# Altium project ash-power.PrjPCB (part 1 of 2)
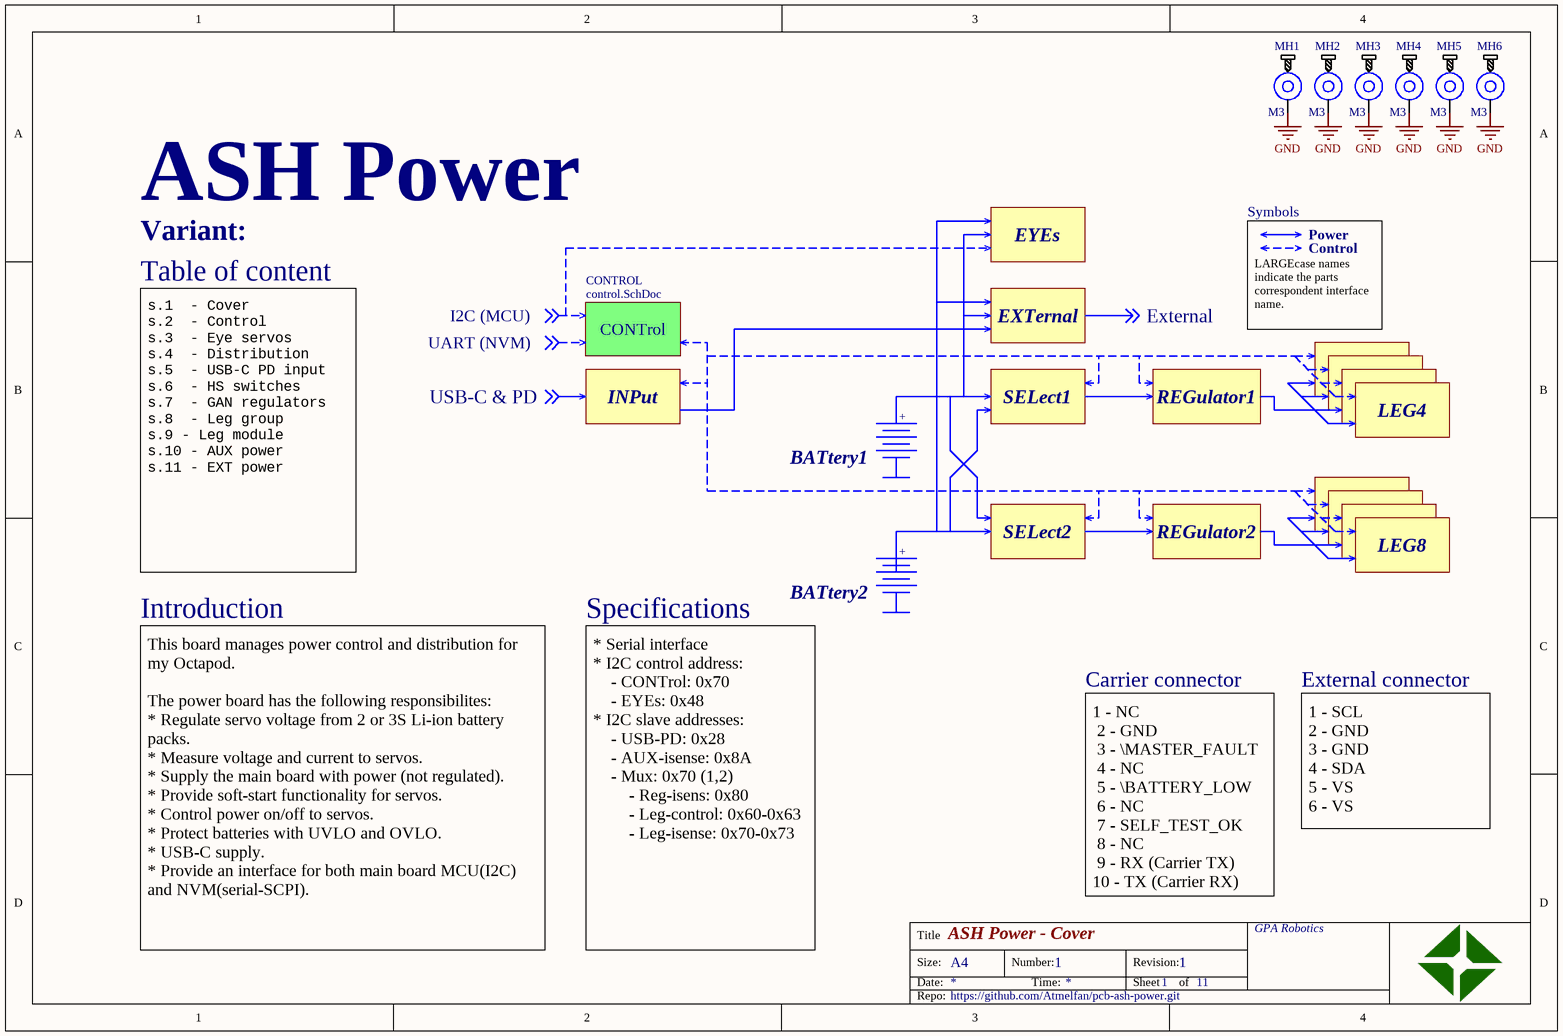
[diagram p0: cover.SchDoc]
project_author: Gustav Palmqvist; project_name: ASH Power; project_repo: https://github.com/Atmelfan/pcb-ash-power.git; project_revision: 1
11 sheets, 589 parts. Net scope: flat (ports and power ports of the same name join across sheets).
Board file: pcb-ash-power.PcbDoc
Sheets:
  cover.SchDoc
    CONTROL = control.SchDoc
      POW = power.SchDoc
        EXT = ext_power.SchDoc
        HS_R = hs_switch.SchDoc
        HS_L = hs_switch.SchDoc
        USB = usbpd_input.SchDoc
        LEG_R = leg_group.SchDoc
          LEG1 = leg_module.SchDoc
          LEG2 = leg_module.SchDoc
          LEG3 = leg_module.SchDoc
          LEG4 = leg_module.SchDoc
        LEG_L = leg_group.SchDoc
          LEG1 = leg_module.SchDoc
          LEG2 = leg_module.SchDoc
          LEG3 = leg_module.SchDoc
          LEG4 = leg_module.SchDoc
        REG_R = gan_buck.SchDoc
        REG_L = gan_buck.SchDoc
      AUX = aux_power.SchDoc
      EYES = servos.SchDoc

## Sheet cover.SchDoc: Cover
size A4; Organization: GPA Robotics; DocumentNumber: 1; SheetNumber: 1; SheetTotal: 11

### Parts
MH1  M3  [mount_m3_normal]
MH2  M3  [mount_m3_normal]
MH3  M3  [mount_m3_normal]
MH4  M3  [mount_m3_normal]
MH5  M3  [mount_m3_normal]
MH6  M3  [mount_m3_normal]

### Sub-sheets
CONTROL = control.SchDoc: no entries

### Nets
GND: MH1.1 MH2.1 MH3.1 MH4.1 MH5.1 MH6.1

### Notes on the sheet
- EYEs
- Symbols
- Power
- Control
- Table of content
- I2C (MCU)
- EXTernal
- External
- UART (NVM)
- CONTrol
- LARGEcase names indicate the parts correspondent interface name.
- USB-C & PD
- INPut
- +
- SELect1
- REGulator1
- LEG4
- BATtery1
- s.1  - Cover
  s.2  - Control
  s.3  - Eye servos
  s.4  - Distribution
  s.5  - USB-C PD input
  s.6  - HS switches
  s.7  - GAN regulators
  s.8  - Leg group
  s.9 - Leg module
  s.10 - AUX power
  s.11 - EXT power
- SELect2
- REGulator2
- LEG8
- Introduction
- Specifications
- BATtery2
- Carrier connector
- External connector
- 1 - SCL
  2 - GND
  3 - GND
  4 - SDA
  5 - VS
  6 - VS
- 1 - NC
  2 - GND
  3 - \MASTER_FAULT
  4 - NC
  5 - \BATTERY_LOW
  6 - NC
  7 - SELF_TEST_OK
  8 - NC
  9 - RX (Carrier TX)
  10 - TX (Carrier RX)
- This board manages power control and distribution for my Octapod.
  The power board has the following responsibilites:
  * Regulate servo voltage from 2 or 3S Li-ion battery packs.
  * Measure voltage and current to servos.
  * Supply the main board with power (not regulated).
  * Provide soft-start functionality for servos.
  * Control power on/off to servos.
  * Protect batteries with UVLO and OVLO.
  * USB-C supply.
  * Provide an interface for both main board MCU(I2C) and NVM(serial-SCPI).
- * Serial interface
  * I2C control address:
  - CONTrol: 0x70
  - EYEs: 0x48
  * I2C slave addresses:
  - USB-PD: 0x28
  - AUX-isense: 0x8A
  - Mux: 0x70 (1,2)
  - Reg-isens: 0x80
  - Leg-control: 0x60-0x63
  - Leg-isense: 0x70-0x73
- Variant:
- Title
- Size:
- Date:
- A4
- Number:
- Time:
- Revision:
- Sheet
- of
- Repo:

### Library data of the parts
MH1-MH6 = mounting_hole: Mounting hole

## Sheet control.SchDoc: Control
size A4; Organization: GPA Robotics; DocumentNumber: 2; Revision: REV 0; SheetNumber: 2; SheetTotal: 11
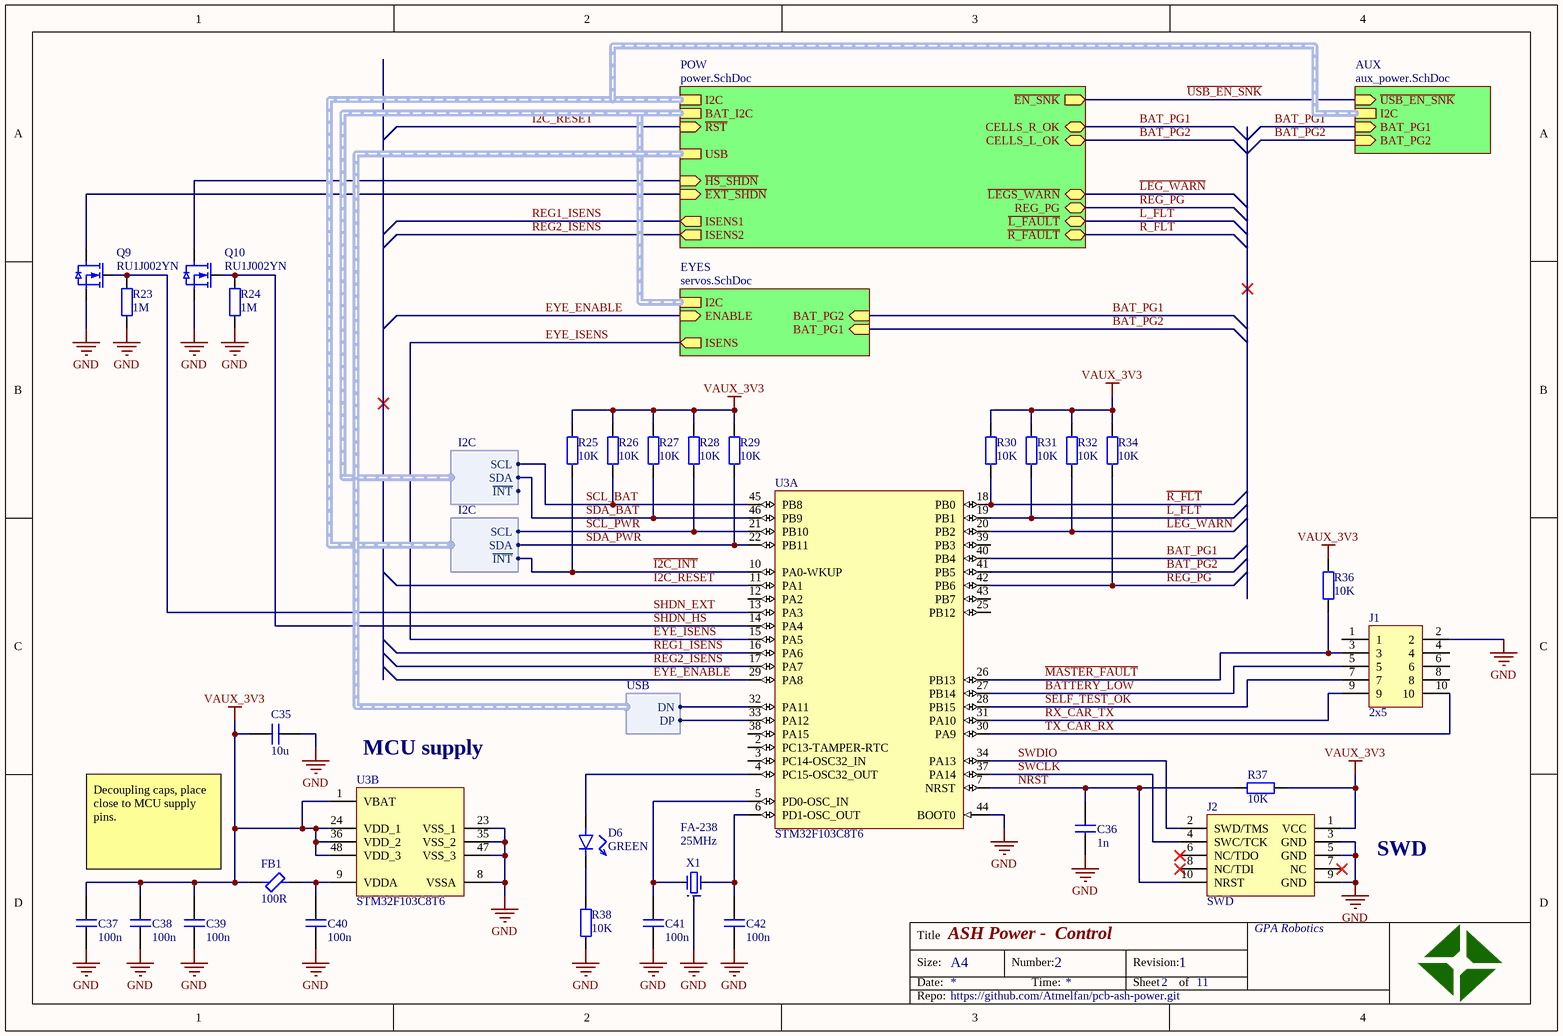
[diagram p1: control.SchDoc]

### Parts
C35  value 10u  [CAPC3216X14N]  (hidden comment: cap)
C36  value 1n  [CAPC1005X06N]  (hidden comment: cap)
C37  value 100n  [CAPC1005X06N]  (hidden comment: cap)
C38  value 100n  [CAPC1005X06N]  (hidden comment: cap)
C39  value 100n  [CAPC1005X06N]  (hidden comment: cap)
C40  value 100n  [CAPC1005X06N]  (hidden comment: cap)
C41  value 100n  [CAPC1005X06N]  (hidden comment: cap)
C42  value 100n  [CAPC1005X06N]  (hidden comment: cap)
D6  value GREEN  [CAPCP1005X06N]  (hidden comment: led)
FB1  value 100R  [INDC1005X06N]  (hidden comment: ferrite)
J1  2x5  [hdr_2x5_50mil]
J2  SWD  [hdr_2x5_50mil]
Q9  RU1J002YN  [SOTFL65P210X105-3N]
Q10  RU1J002YN  [SOTFL65P210X105-3N]
R23  value 1M  [RESC1005X04N]  (hidden comment: res)
R24  value 1M  [RESC1005X04N]  (hidden comment: res)
R25  value 10K  [RESC1005X04N]  (hidden comment: res)
R26  value 10K  [RESC1005X04N]  (hidden comment: res)
R27  value 10K  [RESC1005X04N]  (hidden comment: res)
R28  value 10K  [RESC1005X04N]  (hidden comment: res)
R29  value 10K  [RESC1005X04N]  (hidden comment: res)
R30  value 10K  [RESC1005X04N]  (hidden comment: res)
R31  value 10K  [RESC1005X04N]  (hidden comment: res)
R32  value 10K  [RESC1005X04N]  (hidden comment: res)
R34  value 10K  [RESC1005X04N]  (hidden comment: res)
R36  value 10K  [RESC1005X04N]  (hidden comment: res)
R37  value 10K  [RESC1005X04N]  (hidden comment: res)
R38  value 10K  [RESC1005X04N]  (hidden comment: res)
U3  STM32F103C8T6  [STM-LQFP48_N]  (parts A,B of 2)
X1  FA-238  freq: 25MHz  [DFN220P320X70-4N]

### Sub-sheets
AUX = aux_power.SchDoc: BAT_PG2 (in), BAT_PG1 (in), ~{USB_EN_SNK} (in), I2C (harness I2C)
EYES = servos.SchDoc: ISENS (out), BAT_PG2 (in), BAT_PG1 (in), I2C (harness I2C), ENABLE (in)
POW = power.SchDoc: ~{RST} (in), ~{HS_SHDN} (in), CELLS_R_OK (bidir), ~{LEGS_WARN} (bidir), CELLS_L_OK (bidir), ~{L_FAULT} (bidir), ~{R_FAULT} (bidir), ~{EN_SNK} (out), I2C (harness I2C), BAT_I2C (harness I2C), ~{EXT_SHDN} (in), ISENS1 (out), ISENS2 (out), REG_PG (bidir), USB (harness USB)

### Harnesses
I2C: SDA, SCL, ~{INT}
USB: DP, DN

### Nets
GND: C35.2 C36.1 C37.1 C38.1 C39.1 C40.1 C41.1 C42.1 J1.2 J2.3(GND) J2.5(GND) J2.9(GND) Q9.2(S) Q10.2(S) R23.1 R24.1 R38.1 U3.8(VSSA) U3.23(VSS_1) U3.35(VSS_2) U3.44(BOOT0) U3.47(VSS_3) X1.SHIELD
VAUX_3V3: C35.1 C37.2 C38.2 C39.2 FB1.1 J2.1(VCC) R25.2 R26.2 R27.2 R28.2 R29.2 R30.2 R31.2 R32.2 R34.2 R36.2 R37.1 U3.1(VBAT) U3.24(VDD_1) U3.36(VDD_2) U3.48(VDD_3)
~{BATTERY_LOW}: J1.5 U3.27(PB14)
~{I2C_INT}: R25.1 U3.10(PA0-WKUP) ; sheet POW/I2C.~{INT}
~{L_FLT}: R31.1 U3.19(PB1) ; sheet POW/~{L_FAULT}
~{LEG_WARN}: R32.1 U3.20(PB2) ; sheet POW/~{LEGS_WARN}
~{MASTER_FAULT}: J1.3 R36.1 U3.26(PB13)
~{R_FLT}: R30.1 U3.18(PB0) ; sheet POW/~{R_FAULT}
~{USB_EN_SNK}: sheet POW/~{EN_SNK}, sheet AUX/~{USB_EN_SNK}
BAT_PG1: U3.40(PB4) ; sheet POW/CELLS_R_OK, sheet AUX/BAT_PG1, sheet EYES/BAT_PG2
BAT_PG2: U3.41(PB5) ; sheet POW/CELLS_L_OK, sheet AUX/BAT_PG2, sheet EYES/BAT_PG1
EYE_ENABLE: U3.29(PA8) ; sheet EYES/ENABLE
EYE_ISENS: U3.15(PA5) ; sheet EYES/ISENS
I2C_RESET: U3.11(PA1) ; sheet POW/~{RST}
NRST: C36.2 J2.10(NRST) R37.2 U3.7(NRST)
REG1_ISENS: U3.16(PA6) ; sheet POW/ISENS1
REG2_ISENS: U3.17(PA7) ; sheet POW/ISENS2
REG_PG: R34.1 U3.42(PB6) ; sheet POW/REG_PG
RX_CAR_TX: J1.9 U3.31(PA10)
SCL_BAT: R26.1 U3.45(PB8) ; sheet POW/BAT_I2C.SCL
SCL_PWR: R28.1 U3.21(PB10) ; sheet POW/I2C.SCL
SDA_BAT: R27.1 U3.46(PB9) ; sheet POW/BAT_I2C.SDA
SDA_PWR: R29.1 U3.22(PB11) ; sheet POW/I2C.SDA
SELF_TEST_OK: J1.7 U3.28(PB15)
SHDN_EXT: Q9.1(G) R23.2 U3.13(PA3)
SHDN_HS: Q10.1(G) R24.2 U3.14(PA4)
SWCLK: J2.4(SWC/TCK) U3.37(PA14)
SWDIO: J2.2(SWD/TMS) U3.34(PA13)
TX_CAR_RX: J1.10 U3.30(PA9)
NetC40_2: C40.2 FB1.2 U3.9(VDDA)
NetC41_2: C41.2 U3.5(PD0-OSC_IN) X1.1
NetC42_2: C42.2 U3.6(PD1-OSC_OUT) X1.2
NetD6_A: D6.A U3.4(PC15-OSC32_OUT)
NetD6_C: D6.C R38.2
NetQ9_3: Q9.3(D) ; sheet POW/~{EXT_SHDN}
NetQ10_3: Q10.3(D) ; sheet POW/~{HS_SHDN}
NetU3_32: U3.32(PA11) ; sheet POW/USB.DN
NetU3_33: U3.33(PA12) ; sheet POW/USB.DP

Not connected (* = marked no-connect by the designer): J1 1 4 6 8; J2 6(NC/TDO)* 7(NC)* 8(NC/TDI)*; U3 2(PC13-TAMPER-RTC) 3(PC14-OSC32_IN) 12(PA2) 25(PB12) 38(PA15) 39(PB3) 43(PB7)

### Buses and harness runs
harness sheet AUX/I2C = sheet POW/I2C
harness sheet EYES/I2C = sheet POW/BAT_I2C

### Notes on the sheet
- (near U3) MCU supply
- SWD
- Decoupling caps, place close to MCU supply pins.
- Title
- Size:
- Date:
- A4
- Number:
- Time:
- Revision:
- Sheet
- of
- Repo:

### Library data of the parts
C35-C42 = cap: Capacitor; voltage: *; type: *; #digikey: *; #mouser: *
D6 = led: pin to pad: A>1 C>2
FB1 = ferrite: Inductor; #digikey: *; #mouser: *
J1 = hdr_2x5: 2x5 Header
J2 = hdr_swd: SWD Header
Q9 Q10 = ru1j002yn: N-channel 50V 200mA Small signal MOSFET; ComponentLink1Description: datasheet; ComponentLink1URL: https://www.mouser.se/datasheet/2/348/ru1j002yn-e-1018335.pdf
R23-R32 R34 R36-R38 = res: Resistor; power: *; voltage: *; #digikey: *; #mouser: *
U3 = STM32F103C8T6: ARM Cortex-M3 32-bit MCU, 64 KB Flash, 20 KB Internal RAM, 37 I/Os, 48-pin LQFP, -40 to 85 degC, Tray; A/D Converter: 2x12-bit (10 Channel); FLASH Size (Prog) (kB): 64; I/Os (High Current): 37; Internal RAM Size (kB): 20; Operating Frequency(F) (Processor speed) (MHz): 72; Supply Voltage(Vcc) min (V): 2; DatasheetVersion: Rev. 16; PackageVersion: Rev. 6, 06/2013; PackageReference: LQFP48; PackageDescription: 48-Pin Low Profile Quad Flat Package, 7 x 7 mm Body, 0.5 mm Pitch; Supplier 1: Digi-Key; Supplier Part Number 1: 497-6063-ND; Supplier 2: Farnell; Supplier Part Number 2: 1447637; Supplier 3: Newark; Supplier Part Number 3: 59M2182; Supplier 4: Newark; Supplier Part Number 4: 57P1222; Supplier 5: Mouser; Supplier Part Number 5: 511-STM32F103C8T6; Core: ARM Cortex-M3; Packing: Tray; Mounting Technology: Surface Mount; PartNumber: STM32F103C8T6; ComponentLink1Description: Manufacturer URL; ComponentLink1URL: http://www.st.com/web/en/home.html; ComponentLink2Description: Datasheet; ComponentLink2URL: http://www.st.com/st-web-ui/static/active/en/resource/technical/document/datasheet/CD00161566.pdf; ComponentLink3Description: Package Specification; ComponentLink3URL: http://www.st.com/st-web-ui/static/active/en/resource/technical/document/datasheet/DM00058181.pdf
X1 = crystal: Crystal With Shield; #digikey: *; #mouser: *

## Sheet power.SchDoc: Power
size A3; Organization: GPA Robotics; DocumentNumber: 4; Revision: REV 0; SheetNumber: 4; SheetTotal: 11
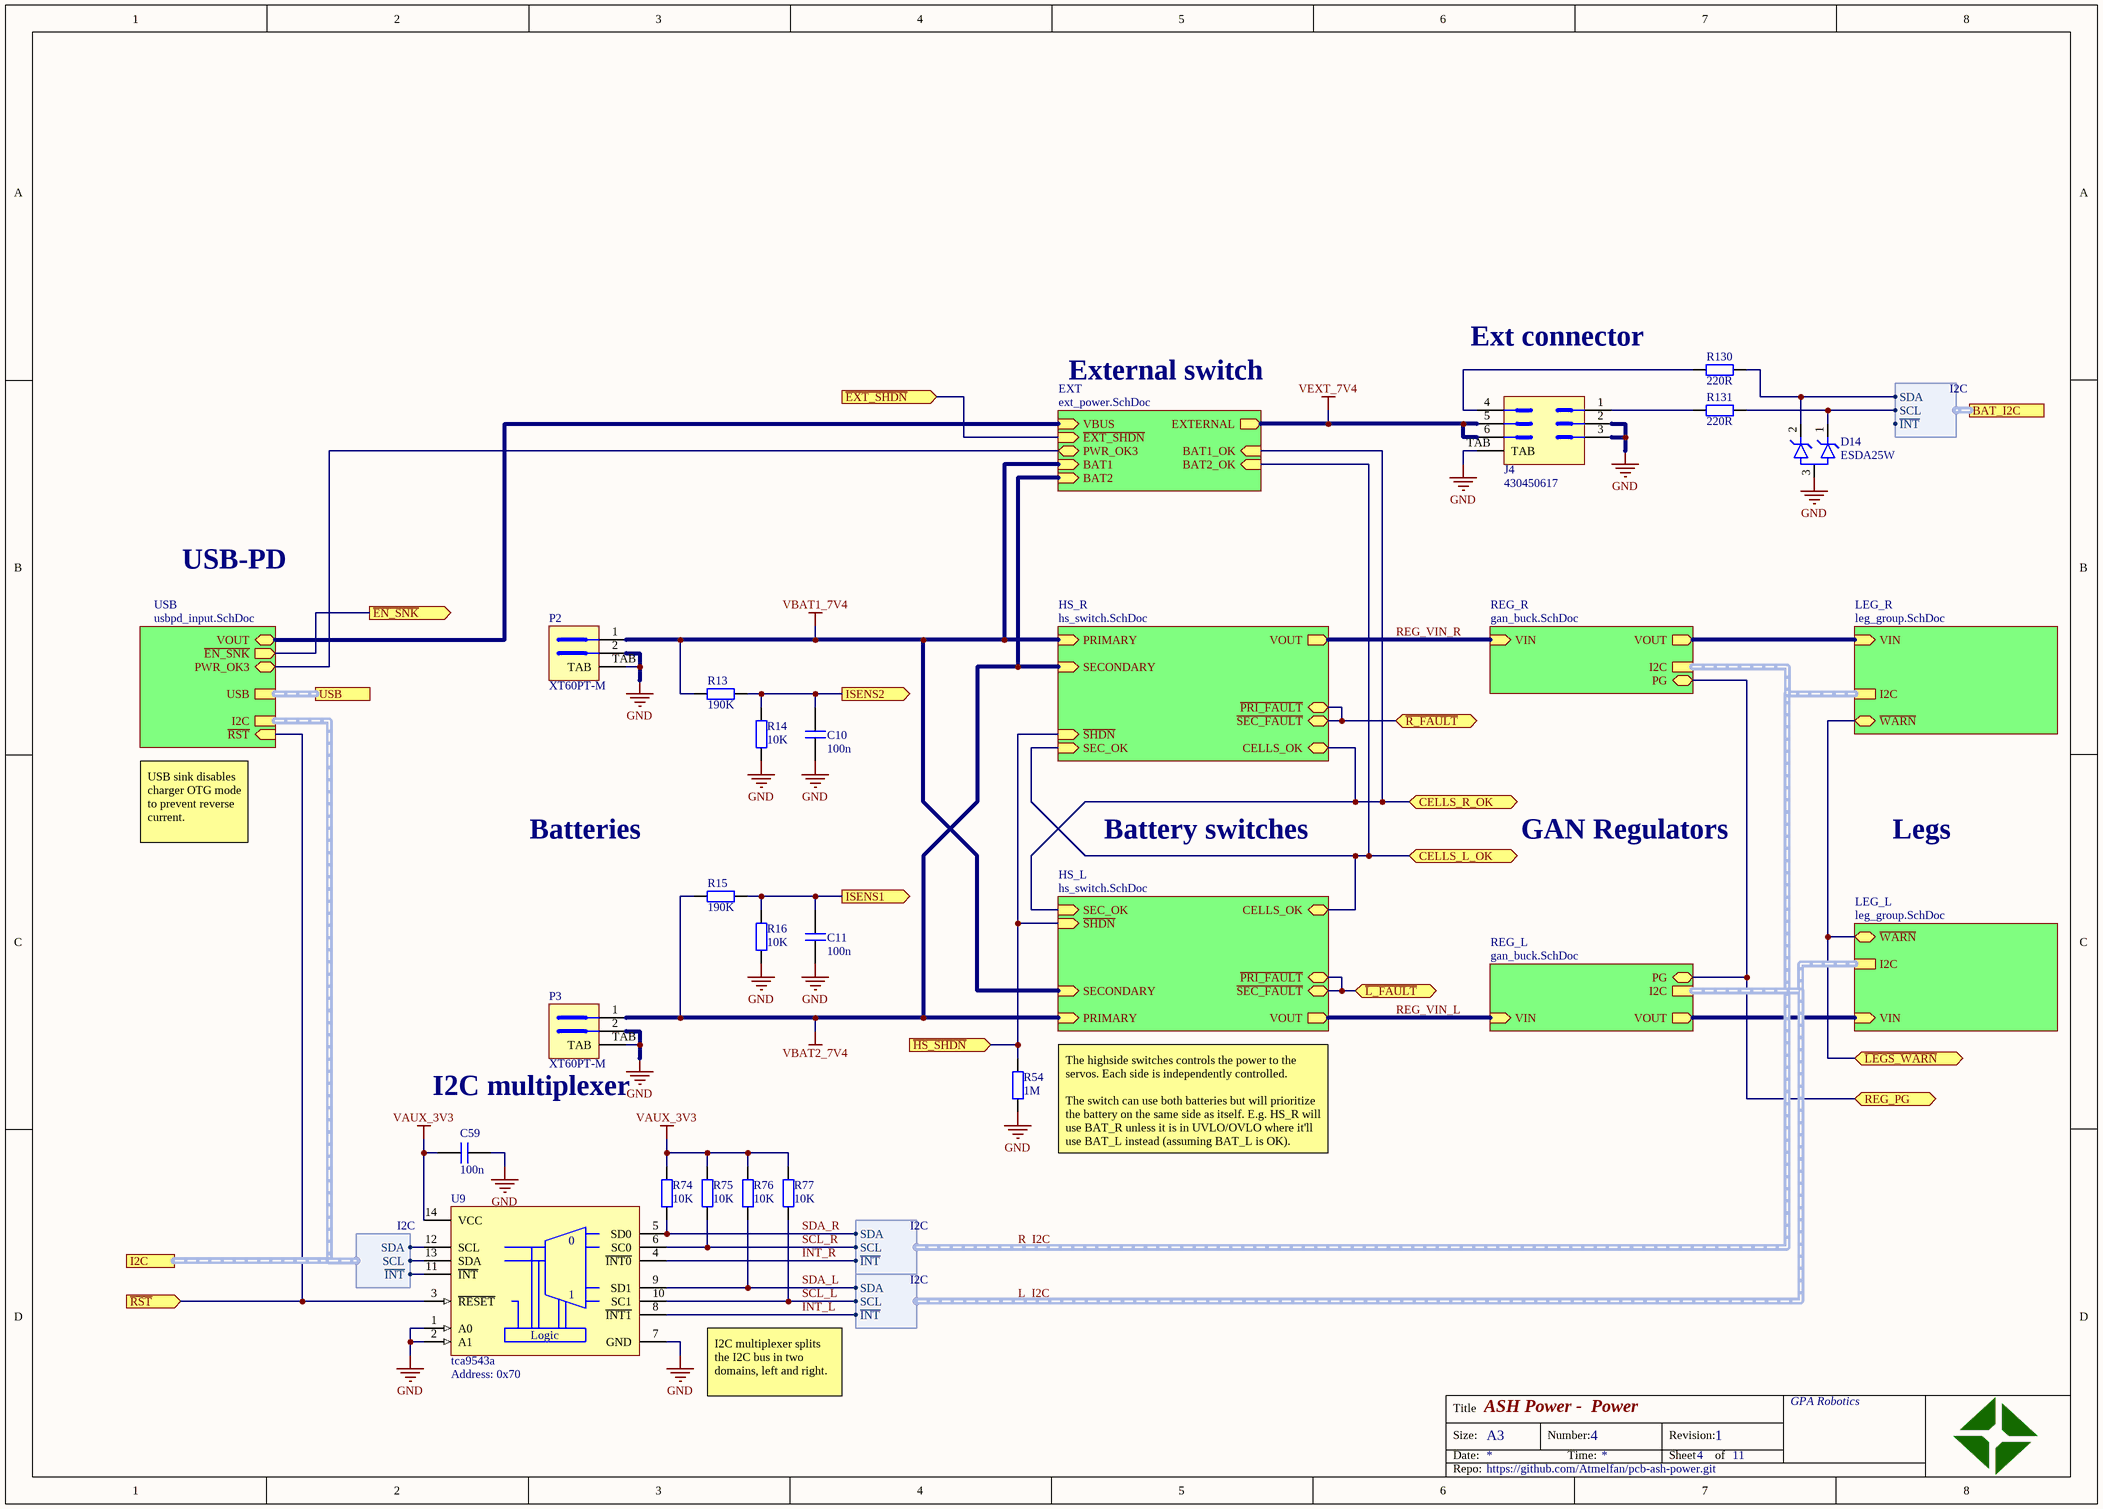
[diagram p2: power.SchDoc]

### Parts
C10  value 100n  [CAPC1005X06N]  (hidden comment: cap)
C11  value 100n  [CAPC1005X06N]  (hidden comment: cap)
C59  value 100n  [CAPC1005X06N]  (hidden comment: cap)
D14  ESDA25W  [SOT65P210X110-3N_SOT323-3L]
J4  430450617  [430450617]
P2  XT60PT-M  [XT60PT-M]
P3  XT60PT-M  [XT60PT-M]
R13  value 190K  [RESC1005X04N]  (hidden comment: res)
R14  value 10K  [RESC1005X04N]  (hidden comment: res)
R15  value 190K  [RESC1005X04N]  (hidden comment: res)
R16  value 10K  [RESC1005X04N]  (hidden comment: res)
R54  value 1M  [RESC1005X04N]  (hidden comment: res)
R74  value 10K  [RESC1005X04N]  (hidden comment: res)
R75  value 10K  [RESC1005X04N]  (hidden comment: res)
R76  value 10K  [RESC1005X04N]  (hidden comment: res)
R77  value 10K  [RESC1005X04N]  (hidden comment: res)
R130  value 220R  [RESC1005X04N]  (hidden comment: res)
R131  value 220R  [RESC1005X04N]  (hidden comment: res)
U9  tca9543a  Address: 0x70  [TSOP65P640X120-14N_PCA9543A]

### Sub-sheets
EXT = ext_power.SchDoc: BAT1 (in), BAT2 (in), VBUS (in), BAT1_OK (in), EXTERNAL (out), BAT2_OK (in), ~{EXT_SHDN} (in), PWR_OK3 (bidir)
HS_L = hs_switch.SchDoc: PRIMARY (in), SECONDARY (in), SEC_OK (in), CELLS_OK (bidir), VOUT (out), ~{SEC_FAULT} (bidir), ~{PRI_FAULT} (bidir), ~{SHDN} (in)
HS_R = hs_switch.SchDoc: PRIMARY (in), SECONDARY (in), SEC_OK (in), CELLS_OK (bidir), VOUT (out), ~{PRI_FAULT} (bidir), ~{SEC_FAULT} (bidir), ~{SHDN} (in)
LEG_L = leg_group.SchDoc: VIN (in), ~{WARN} (bidir), I2C (harness I2C)
LEG_R = leg_group.SchDoc: VIN (in), ~{WARN} (bidir), I2C (harness I2C)
REG_L = gan_buck.SchDoc: VOUT (out), VIN (in), PG (bidir), I2C (harness I2C)
REG_R = gan_buck.SchDoc: VOUT (out), VIN (in), PG (bidir), I2C (harness I2C)
USB = usbpd_input.SchDoc: VOUT (bidir), ~{RST} (in), ~{EN_SNK} (out), I2C (harness I2C), USB (harness USB), PWR_OK3 (bidir)

### Ports
BAT_I2C (harness I2C), CELLS_L_OK (bidir), CELLS_R_OK (bidir), I2C (harness I2C), ISENS1 (out), ISENS2 (out), REG_PG (bidir), USB (harness USB), ~{EN_SNK} (out), ~{EXT_SHDN} (in), ~{HS_SHDN} (in), ~{L_FAULT} (bidir), ~{LEGS_WARN} (bidir), ~{R_FAULT} (bidir), ~{RST} (in)

### Harnesses
I2C: SDA, SCL, ~{INT}

### Nets
GND: C10.1 C11.1 C59.2 D14.3 J4.2 J4.3 J4.TAB P2.2 P2.TAB P3.2 P3.TAB R14.1 R16.1 R54.1 U9.1(A0) U9.2(A1) U9.7(GND)
VAUX_3V3: C59.1 R74.2 R75.2 R76.2 R77.2 U9.14(VCC)
VBAT1_7V4: P2.1 R13.1 ; sheet EXT/BAT1, sheet HS_R/PRIMARY, sheet HS_L/SECONDARY
VBAT2_7V4: P3.1 R15.1 ; sheet EXT/BAT2, sheet HS_R/SECONDARY, sheet HS_L/PRIMARY
VEXT_7V4: J4.5 J4.6 ; sheet EXT/EXTERNAL
~{EXT_SHDN}: port ~{EXT_SHDN}, sheet EXT/~{EXT_SHDN}
~{INT_L}: U9.8(~{INT1}) ; sheet LEG_L/I2C.~{INT}
~{INT_R}: U9.4(~{INT0}) ; sheet LEG_R/I2C.~{INT}
REG_VIN_L: sheet HS_L/VOUT, sheet REG_L/VIN
REG_VIN_R: sheet HS_R/VOUT, sheet REG_R/VIN
SCL_L: R77.1 U9.10(SC1) ; sheet LEG_L/I2C.SCL  [project net L_I2C.SCL]
SCL_R: R75.1 U9.6(SC0) ; sheet LEG_R/I2C.SCL  [project net R_I2C.SCL]
SDA_L: R76.1 U9.9(SD1) ; sheet LEG_L/I2C.SDA  [project net L_I2C.SDA]
SDA_R: R74.1 U9.5(SD0) ; sheet LEG_R/I2C.SDA  [project net R_I2C.SDA]
NetC10_2: C10.2 R13.2 R14.2 ; port ISENS2
NetC11_2: C11.2 R15.2 R16.2 ; port ISENS1
NetD14_1: D14.1 R131.2 ; port BAT_I2C.SCL
NetD14_2: D14.2 R130.2 ; port BAT_I2C.SDA
NetID3_CONTROL_POW_LEG_L_LEG1_2: U9.13(SDA) ; port I2C.SCL
NetID4_CONTROL_POW_LEG_L_LEG1_2: U9.12(SCL) ; port I2C.SDA
NetJ4_1: J4.1 R131.1
NetJ4_4: J4.4 R130.1
NetQ24_1: U9.3(~{RESET}) ; port ~{RST}, sheet USB/~{RST}
NetR54_2: R54.2 ; port ~{HS_SHDN}, sheet HS_R/~{SHDN}, sheet HS_L/~{SHDN}
NetR99_1: port ~{EN_SNK}, sheet USB/~{EN_SNK}
NetR103_2: U9.11(~{INT}) ; port I2C.~{INT}
(unnamed): port CELLS_R_OK, sheet EXT/BAT1_OK, sheet HS_R/CELLS_OK, sheet HS_L/SEC_OK
(unnamed): port CELLS_L_OK, sheet EXT/BAT2_OK, sheet HS_R/SEC_OK, sheet HS_L/CELLS_OK
(unnamed): port ~{LEGS_WARN}, sheet LEG_R/~{WARN}, sheet LEG_L/~{WARN}
(unnamed): port ~{R_FAULT}, sheet HS_R/~{PRI_FAULT}, sheet HS_R/~{SEC_FAULT}
(unnamed): port ~{L_FAULT}, sheet HS_L/~{SEC_FAULT}, sheet HS_L/~{PRI_FAULT}
(unnamed): port REG_PG, sheet REG_R/PG, sheet REG_L/PG
(unnamed): sheet EXT/VBUS, sheet USB/VOUT
(unnamed): sheet EXT/PWR_OK3, sheet USB/PWR_OK3
(unnamed): sheet LEG_R/VIN, sheet REG_R/VOUT
(unnamed): sheet LEG_L/VIN, sheet REG_L/VOUT

### Buses and harness runs
harness L_I2C = sheet LEG_L/I2C = sheet REG_L/I2C
harness port I2C = sheet USB/I2C
harness port USB = sheet USB/USB
harness R_I2C = sheet LEG_R/I2C = sheet REG_R/I2C

### Notes on the sheet
- External switch
- Ext connector
- USB-PD
- USB sink disables charger OTG mode to prevent reverse current.
- Batteries
- Battery switches
- GAN Regulators
- Legs
- (near P3) I2C multiplexer
- (near R54) The highside switches controls the power to the servos. Each side is independently controlled.
  The switch can use both batteries but will prioritize the battery on the same side as itself. E.g. HS_R will use BAT_R unless it is in UVLO/OVLO where it'll use BAT_L instead (assuming BAT_L is OK).
- I2C multiplexer splits the I2C bus in two domains, left and right.
- Title
- Size:
- Date:
- A3
- Number:
- Time:
- Revision:
- Sheet
- of
- Repo:
- (in symbol tca9543a) 0; Logic

### Library data of the parts
C10 C11 C59 = cap: Capacitor; voltage: *; type: *; #digikey: *; #mouser: *
D14 = esda25w: TRANSIL array for data protection; ComponentLink1Description: datasheet; ComponentLink1URL: https://www.st.com/content/ccc/resource/technical/document/datasheet/cd/9b/8d/39/1f/d4/43/ba/CD00064033.pdf/files/CD00064033.pdf/jcr:content/translations/en.CD00064033.pdf
J4 = 430450617: Micro-Fit 3.0 Vertical Header, 3.00mm Pitch, Dual Row, 6 Circuits, with PCB Press-fit Metal Retention Clip, Gold, Glow-Wire Capable, Black; ComponentLink1Description: drawing; ComponentLink1URL: https://www.molex.com/pdm_docs/sd/430450617_sd.pdf
R13-R16 R54 R74-R77 R130 R131 = res: Resistor; power: *; voltage: *; #digikey: *; #mouser: *
U9 = tca9543a: Low Voltage 2-Channel I2C Bus Switch With Interrupt Logic And Reset; ComponentLink1Description: datasheet; ComponentLink1URL: http://www.ti.com/lit/ds/symlink/tca9543a.pdf

## Sheet ext_power.SchDoc: External power
size A4; Organization: GPA Robotics; DocumentNumber: 11; Revision: REV 0; SheetNumber: 11; SheetTotal: 11
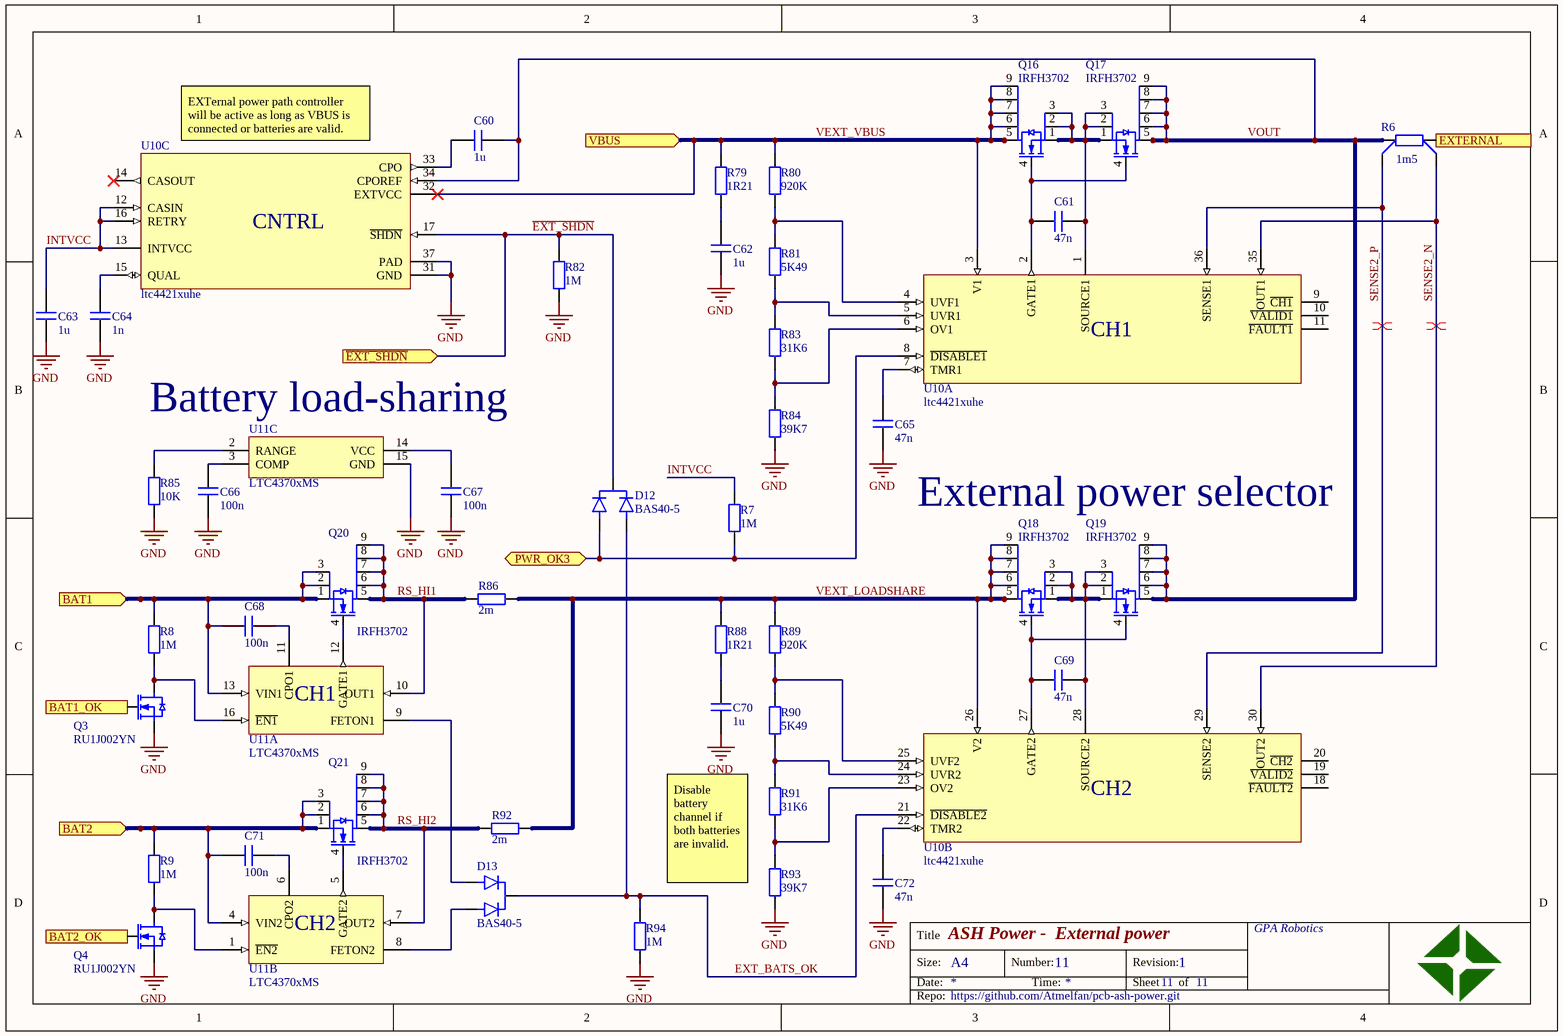
[diagram p3: ext_power.SchDoc]

### Parts
C60  value 1u  [CAPC2012X11N]  (hidden comment: cap)
C61  value 47n  [CAPC1005X06N]  (hidden comment: cap)
C62  value 1u  [CAPC2012X11N]  (hidden comment: cap)
C63  value 1u  [CAPC2012X11N]  (hidden comment: cap)
C64  value 1n  [CAPC1005X06N]  (hidden comment: cap)
C65  value 47n  [CAPC1005X06N]  (hidden comment: cap)
C66  value 100n  [CAPC1005X06N]  (hidden comment: cap)
C67  value 100n  [CAPC1005X06N]  (hidden comment: cap)
C68  value 100n  [CAPC1005X06N]  (hidden comment: cap)
C69  value 47n  [CAPC1005X06N]  (hidden comment: cap)
C70  value 1u  [CAPC2012X11N]  (hidden comment: cap)
C71  value 100n  [CAPC1005X06N]  (hidden comment: cap)
C72  value 47n  [CAPC1005X06N]  (hidden comment: cap)
D12  BAS40-5  [SOT23_CC]
D13  BAS40-5  [SOT23_CC]
Q3  RU1J002YN  [SOTFL65P210X105-3N]
Q4  RU1J002YN  [SOTFL65P210X105-3N]
Q16  IRFH3702  [PQFN67P300X300X100-8N]
Q17  IRFH3702  [PQFN67P300X300X100-8N]
Q18  IRFH3702  [PQFN67P300X300X100-8N]
Q19  IRFH3702  [PQFN67P300X300X100-8N]
Q20  IRFH3702  [PQFN67P300X300X100-8N]
Q21  IRFH3702  [PQFN67P300X300X100-8N]
R6  value 1m5  [4T_RESC1632X05N]  (hidden comment: res_4t)
R7  value 1M  [RESC1005X04N]  (hidden comment: res)
R8  value 1M  [RESC1005X04N]  (hidden comment: res)
R9  value 1M  [RESC1005X04N]  (hidden comment: res)
R79  value 1R21  [RESC2012X06N]  (hidden comment: res)
R80  value 920K  [RESC1005X04N]  (hidden comment: res)
R81  value 5K49  [RESC1005X04N]  (hidden comment: res)
R82  value 1M  [RESC1005X04N]  (hidden comment: res)
R83  value 31K6  [RESC1005X04N]  (hidden comment: res)
R84  value 39K7  [RESC1005X04N]  (hidden comment: res)
R85  value 10K  [RESC1005X04N]  (hidden comment: res)
R86  value 2m  [RESC3216X07N]  (hidden comment: res)
R88  value 1R21  [RESC2012X06N]  (hidden comment: res)
R89  value 920K  [RESC1005X04N]  (hidden comment: res)
R90  value 5K49  [RESC1005X04N]  (hidden comment: res)
R91  value 31K6  [RESC1005X04N]  (hidden comment: res)
R92  value 2m  [RESC3216X07N]  (hidden comment: res)
R93  value 39K7  [RESC1005X04N]  (hidden comment: res)
R94  value 1M  [RESC1005X04N]  (hidden comment: res)
U10  ltc4421xuhe  [QFN50P500X600X80_HS-37N_LTC4421]  (parts A,B,C of 3)
U11  LTC4370xMS  [TSSOP50P510X110-16N_ltc4421]  (parts A,B,C of 3)

### Ports
BAT1 (in), BAT1_OK (in), BAT2 (in), BAT2_OK (in), EXTERNAL (out), PWR_OK3 (bidir), VBUS (in), ~{EXT_SHDN} (in)

### Nets
GND: C62.1 C63.1 C64.1 C65.1 C66.1 C67.1 C70.1 C72.1 Q3.2(S) Q4.2(S) R82.1 R84.1 R85.1 R93.1 R94.1 U10.31(GND) U10.37(PAD) U11.15(GND)
~{EXT_SHDN}: D12.C R82.2 U10.17(~{SHDN}) ; port ~{EXT_SHDN}
EXT_BATS_OK: D12.A1 D13.C R94.2 U10.21(~{DISABLE2})
INTVCC: C63.2 R7.2 U10.12(CASIN) U10.13(INTVCC) U10.16(RETRY)
RS_HI1: Q20.5(D) Q20.6(D) Q20.7(D) Q20.8(D) Q20.9(D) R86.1 U11.10(OUT1)
RS_HI2: Q21.5(D) Q21.6(D) Q21.7(D) Q21.8(D) Q21.9(D) R92.1 U11.7(OUT2)
SENSE2_N: R6.4 U10.30(OUT2) U10.35(OUT1)
SENSE2_P: R6.3 U10.29(SENSE2) U10.36(SENSE1)
VEXT_LOADSHARE: Q18.5(D) Q18.6(D) Q18.7(D) Q18.8(D) Q18.9(D) R86.2 R88.2 R89.2 R92.2 U10.26(V2)
VEXT_VBUS: Q16.5(D) Q16.6(D) Q16.7(D) Q16.8(D) Q16.9(D) R79.2 R80.2 U10.3(V1) U10.32(EXTVCC) ; port VBUS
VOUT: C60.2 Q17.5(D) Q17.6(D) Q17.7(D) Q17.8(D) Q17.9(D) Q19.5(D) Q19.6(D) Q19.7(D) Q19.8(D) Q19.9(D) R6.1 U10.34(CPOREF)
NetC60_1: C60.1 U10.33(CPO)
NetC61_1: C61.1 Q16.4(G) Q17.4(G) U10.2(GATE1)
NetC61_2: C61.2 Q16.1(S) Q16.2(S) Q16.3(S) Q17.1(S) Q17.2(S) Q17.3(S) U10.1(SOURCE1)
NetC62_2: C62.2 R79.1
NetC64_2: C64.2 U10.15(QUAL)
NetC65_2: C65.2 U10.7(TMR1)
NetC66_2: C66.2 U11.3(COMP)
NetC67_2: C67.2 U11.14(VCC)
NetC68_1: C68.1 Q20.1(S) Q20.2(S) Q20.3(S) R8.2 U11.13(VIN1) ; port BAT1
NetC68_2: C68.2 U11.11(CPO1)
NetC69_1: C69.1 Q18.4(G) Q19.4(G) U10.27(GATE2)
NetC69_2: C69.2 Q18.1(S) Q18.2(S) Q18.3(S) Q19.1(S) Q19.2(S) Q19.3(S) U10.28(SOURCE2)
NetC70_2: C70.2 R88.1
NetC71_1: C71.1 Q21.1(S) Q21.2(S) Q21.3(S) R9.2 U11.4(VIN2) ; port BAT2
NetC71_2: C71.2 U11.6(CPO2)
NetC72_2: C72.2 U10.22(TMR2)
NetD12_A2: D12.A2 R7.1 U10.8(~{DISABLE1}) ; port PWR_OK3
NetD13_A1: D13.A1 U11.9(FETON1)
NetD13_A2: D13.A2 U11.8(FETON2)
NetQ3_1: Q3.1(G) ; port BAT1_OK
NetQ3_3: Q3.3(D) R8.1 U11.16(~{EN1})
NetQ4_1: Q4.1(G) ; port BAT2_OK
NetQ4_3: Q4.3(D) R9.1 U11.1(~{EN2})
NetQ20_4: Q20.4(G) U11.12(GATE1)
NetQ21_4: Q21.4(G) U11.5(GATE2)
NetR6_2: R6.2 ; port EXTERNAL
NetR80_1: R80.1 R81.2 U10.4(UVF1)
NetR81_1: R81.1 R83.2 U10.5(UVR1)
NetR83_1: R83.1 R84.2 U10.6(OV1)
NetR85_2: R85.2 U11.2(RANGE)
NetR89_1: R89.1 R90.2 U10.25(UVF2)
NetR90_1: R90.1 R91.2 U10.24(UVR2)
NetR91_1: R91.1 R93.2 U10.23(OV2)

Not connected (* = marked no-connect by the designer): U10 9(~{CH1}) 10(~{VALID1}) 11(~{FAULT1}) 14(CASOUT)* 18(~{FAULT2}) 19(~{VALID2}) 20(~{CH2})

### Layout directives
differential pair: SENSE2_N, SENSE2_P

### Notes on the sheet
- (near U10) EXTernal power path controller will be active as long as VBUS is connected or batteries are valid.
- (near U11) Battery load-sharing
- External power selector
- Disable battery channel if both batteries are invalid.
- Title
- Size:
- Date:
- A4
- Number:
- Time:
- Revision:
- Sheet
- of
- Repo:
- (in symbol ltc4370xms, part A) CH1
- (in symbol ltc4370xms, part B) CH2
- (in symbol ltc4421xuhe, part A) CH1
- (in symbol ltc4421xuhe, part B) CH2
- (in symbol ltc4421xuhe, part C) CNTRL

### Library data of the parts
C60-C72 = cap: Capacitor; voltage: *; type: *; #digikey: *; #mouser: *
D12 D13 = diode_dual_cc: Diode Common Cathode
Q3 Q4 = ru1j002yn: N-channel 50V 200mA Small signal MOSFET; ComponentLink1Description: datasheet; ComponentLink1URL: https://www.mouser.se/datasheet/2/348/ru1j002yn-e-1018335.pdf
Q16-Q21 = irfh3702: HEXFET Power MOSFET; ComponentLink1Description: datasheet; ComponentLink1URL: https://www.infineon.com/dgdl/irfh3702pbf.pdf?fileId=5546d462533600a40153561a25871e76
R6 = res_4t: Resistor; power: *; #digikey: *; #mouser: *
R7-R9 R79-R86 R88-R94 = res: Resistor; power: *; voltage: *; #digikey: *; #mouser: *
U10 = ltc4421xuhe: High Power Prioritized PowerPath Controller; ComponentLink1Description: datasheet; ComponentLink1URL: https://www.analog.com/media/en/technical-documentation/data-sheets/LTC4421.pdf
U11 = ltc4370xms: Two-Supply Diode-OR Current Balancing Controller; ComponentLink1Description: datasheet; ComponentLink1URL: https://www.analog.com/media/en/technical-documentation/data-sheets/4370f.pdf

## Sheet hs_switch.SchDoc: HS Switch
size A4; Organization: GPA Robotics; DocumentNumber: 6; Revision: REV 0; SheetNumber: 6; SheetTotal: 11
Used 2 times, as channels CONTROL/POW/HS_R, CONTROL/POW/HS_L. Parts and nets are listed once, with the designators drawn on the sheet.
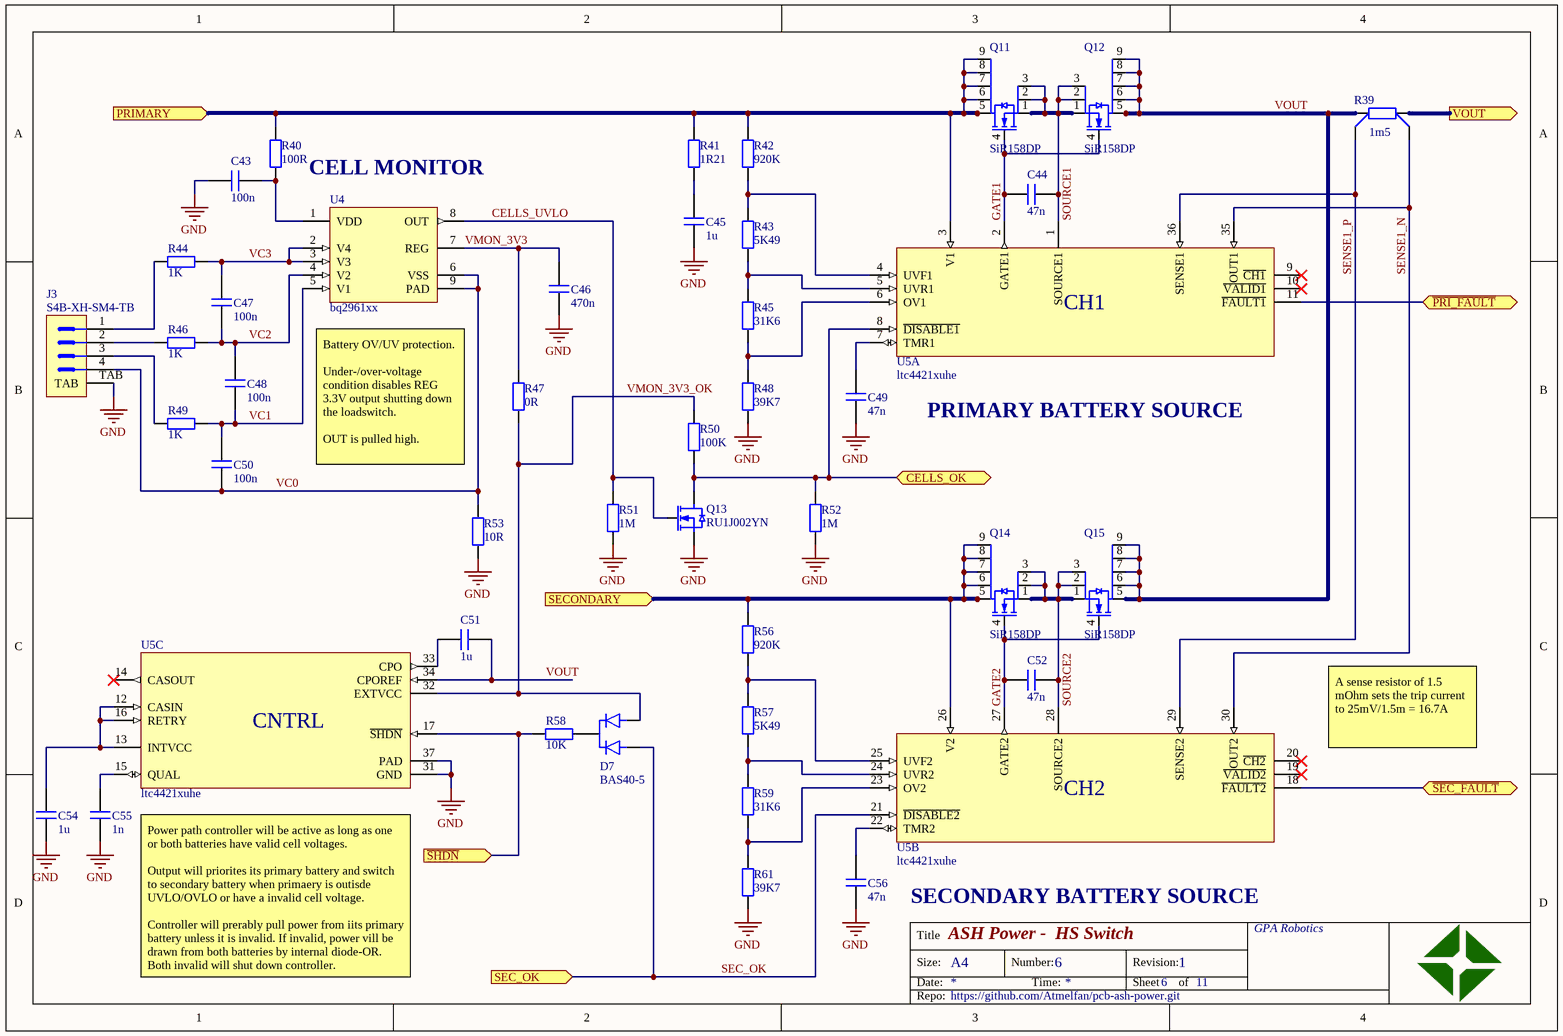
[diagram p4: hs_switch.SchDoc]

### Parts
C43  value 100n  [CAPC1005X06N]  (hidden comment: cap)
C44  value 47n  [CAPC1005X06N]  (hidden comment: cap)
C45  value 1u  [CAPC2012X11N]  (hidden comment: cap)
C46  value 470n  [CAPC2012X11N]  (hidden comment: cap)
C47  value 100n  [CAPC1005X06N]  (hidden comment: cap)
C48  value 100n  [CAPC1005X06N]  (hidden comment: cap)
C49  value 47n  [CAPC1005X06N]  (hidden comment: cap)
C50  value 100n  [CAPC1005X06N]  (hidden comment: cap)
C51  value 1u  [CAPC2012X11N]  (hidden comment: cap)
C52  value 47n  [CAPC1005X06N]  (hidden comment: cap)
C54  value 1u  [CAPC2012X11N]  (hidden comment: cap)
C55  value 1n  [CAPC1005X06N]  (hidden comment: cap)
C56  value 47n  [CAPC1005X06N]  (hidden comment: cap)
D7  BAS40-5  [SOT23_CC]
J3  S4B-XH-SM4-TB  [S4B-XH-SM4-TB]
Q11  SiR158DP  [SON127P620X112_HS-9N_POWERPAK_SO8]
Q12  SiR158DP  [SON127P620X112_HS-9N_POWERPAK_SO8]
Q13  RU1J002YN  [SOTFL65P210X105-3N]
Q14  SiR158DP  [SON127P620X112_HS-9N_POWERPAK_SO8]
Q15  SiR158DP  [SON127P620X112_HS-9N_POWERPAK_SO8]
R39  value 1m5  [4T_RESC1632X05N]  (hidden comment: res_4t)
R40  value 100R  [RESC1005X04N]  (hidden comment: res)
R41  value 1R21  [RESC1005X04N]  (hidden comment: res)
R42  value 920K  [RESC1005X04N]  (hidden comment: res)
R43  value 5K49  [RESC1005X04N]  (hidden comment: res)
R44  value 1K  [RESC1005X04N]  (hidden comment: res)
R45  value 31K6  [RESC1005X04N]  (hidden comment: res)
R46  value 1K  [RESC1005X04N]  (hidden comment: res)
R47  value 0R  [RESC1005X04N]  (hidden comment: res)
R48  value 39K7  [RESC1005X04N]  (hidden comment: res)
R49  value 1K  [RESC1005X04N]  (hidden comment: res)
R50  value 100K  [RESC1005X04N]  (hidden comment: res)
R51  value 1M  [RESC1005X04N]  (hidden comment: res)
R52  value 1M  [RESC1005X04N]  (hidden comment: res)
R53  value 10R  [RESC1005X04N]  (hidden comment: res)
R56  value 920K  [RESC1005X04N]  (hidden comment: res)
R57  value 5K49  [RESC1005X04N]  (hidden comment: res)
R58  value 10K  [RESC1005X04N]  (hidden comment: res)
R59  value 31K6  [RESC1005X04N]  (hidden comment: res)
R61  value 39K7  [RESC1005X04N]  (hidden comment: res)
U4  bq2961xx  [SON50P200X80_HS-9N-BQ2960XX]
U5  ltc4421xuhe  [QFN50P500X600X80_HS-37N_LTC4421]  (parts A,B,C of 3)

### Ports
CELLS_OK (bidir), PRIMARY (in), SEC_OK (in), SECONDARY (in), VOUT (out), ~{PRI_FAULT} (bidir), ~{SEC_FAULT} (bidir), ~{SHDN} (in)

### Nets
GND: C43.1 C45.1 C46.1 C49.1 C54.1 C55.1 C56.1 J3.TAB Q13.2(S) R48.1 R51.1 R52.1 R53.2 R61.1 U5.31(GND) U5.37(PAD)
~{PRI_FAULT}: U5.11(~{FAULT1}) ; port ~{PRI_FAULT}
~{SEC_FAULT}: U5.18(~{FAULT2}) ; port ~{SEC_FAULT}
~{SHDN}: R58.1 U5.17(~{SHDN}) ; port ~{SHDN}
CELLS_OK: Q13.3(D) R50.1 R52.2 U5.8(~{DISABLE1}) ; port CELLS_OK
CELLS_UVLO: Q13.1(G) R51.2 U4.8(OUT)
GATE1: C44.1 Q11.4(G) Q12.4(G) U5.2(GATE1)
GATE2: C52.1 Q14.4(G) Q15.4(G) U5.27(GATE2)
PRIMARY: Q11.5(D) Q11.6(D) Q11.7(D) Q11.8(D) Q11.9(D) R40.2 R41.2 R42.2 U5.3(V1) ; port PRIMARY
SEC_OK: D7.A1 U5.21(~{DISABLE2}) ; port SEC_OK
SECONDARY: Q14.5(D) Q14.6(D) Q14.7(D) Q14.8(D) Q14.9(D) R56.2 U5.26(V2) ; port SECONDARY
SENSE1_N: R39.4 U5.30(OUT2) U5.35(OUT1)
SENSE1_P: R39.3 U5.29(SENSE2) U5.36(SENSE1)
SOURCE1: C44.2 Q11.1(S) Q11.2(S) Q11.3(S) Q12.1(S) Q12.2(S) Q12.3(S) U5.1(SOURCE1)
SOURCE2: C52.2 Q14.1(S) Q14.2(S) Q14.3(S) Q15.1(S) Q15.2(S) Q15.3(S) U5.28(SOURCE2)
VC0: C50.1 J3.4 R53.1 U4.6(VSS) U4.9(PAD)
VC1: C48.1 C50.2 R49.2 U4.5(V1)
VC2: C47.1 C48.2 R46.2 U4.4(V2)
VC3: C47.2 R44.2 U4.2(V4) U4.3(V3)
VMON_3V3: C46.2 R47.2 U4.7(REG)
VMON_3V3_OK: D7.A2 R47.1 R50.2 U5.32(EXTVCC)
VOUT: C51.2 Q12.5(D) Q12.6(D) Q12.7(D) Q12.8(D) Q12.9(D) Q15.5(D) Q15.6(D) Q15.7(D) Q15.8(D) Q15.9(D) R39.1 U5.34(CPOREF)
VOUT: R39.2 ; port VOUT  [a separate net that carries the same name]
NetC43_2: C43.2 R40.1 U4.1(VDD)
NetC45_2: C45.2 R41.1
NetC49_2: C49.2 U5.7(TMR1)
NetC51_1: C51.1 U5.33(CPO)
NetC54_2: C54.2 U5.12(CASIN) U5.13(INTVCC) U5.16(RETRY)
NetC55_2: C55.2 U5.15(QUAL)
NetC56_2: C56.2 U5.22(TMR2)
NetD7_C: D7.C R58.2
NetJ3_1: J3.1 R44.1
NetJ3_2: J3.2 R46.1
NetJ3_3: J3.3 R49.1
NetR42_1: R42.1 R43.2 U5.4(UVF1)
NetR43_1: R43.1 R45.2 U5.5(UVR1)
NetR45_1: R45.1 R48.2 U5.6(OV1)
NetR56_1: R56.1 R57.2 U5.25(UVF2)
NetR57_1: R57.1 R59.2 U5.24(UVR2)
NetR59_1: R59.1 R61.2 U5.23(OV2)

Not connected (* = marked no-connect by the designer): U5 9(~{CH1})* 10(~{VALID1})* 14(CASOUT)* 19(~{VALID2})* 20(~{CH2})*

### Channels
CONTROL/POW/HS_R: designators end in _HS_R; ports CELLS_OK=NetQ13_HS_L_3 PRIMARY=NetQ11_HS_L_5 SEC_OK=SEC_OK SECONDARY=NetQ14_HS_L_5 VOUT=VOUT ~{PRI_FAULT}=NetU5_HS_L_11 ~{SEC_FAULT}=NetU5_HS_L_18 ~{SHDN}=NetR58_HS_L_1
CONTROL/POW/HS_L: designators end in _HS_L; ports CELLS_OK=NetQ13_HS_L_3 PRIMARY=NetQ11_HS_L_5 SEC_OK=SEC_OK SECONDARY=NetQ14_HS_L_5 VOUT=VOUT ~{PRI_FAULT}=NetU5_HS_L_11 ~{SEC_FAULT}=NetU5_HS_L_18 ~{SHDN}=NetR58_HS_L_1

### Notes on the sheet
- CELL MONITOR
- PRIMARY BATTERY SOURCE
- Battery OV/UV protection.
  Under-/over-voltage condition disables REG 3.3V output shutting down the loadswitch.
  OUT is pulled high.
- A sense resistor of 1.5 mOhm sets the trip current to 25mV/1.5m = 16.7A
- SECONDARY BATTERY SOURCE
- Power path controller will be active as long as one or both batteries have valid cell voltages.
  Output will priorites its primary battery and switch to secondary battery when primaery is outisde UVLO/OVLO or have a invalid cell voltage.
  Controller will prerably pull power from iits primary battery unless it is invalid. If invalid, power vill be drawn from both batteries by internal diode-OR. Both invalid will shut down controller.
- Title
- Size:
- Date:
- A4
- Number:
- Time:
- Revision:
- Sheet
- of
- Repo:
- (in symbol ltc4421xuhe, part A) CH1
- (in symbol ltc4421xuhe, part B) CH2
- (in symbol ltc4421xuhe, part C) CNTRL

### Library data of the parts
C43-C52 C54-C56 = cap: Capacitor; voltage: *; type: *; #digikey: *; #mouser: *
D7 = diode_dual_cc: Diode Common Cathode
J3 = s4b-xh-sm4-tb: 2.5mm pitch/Disconnectable Crimp style connectors; ComponentLink1Description: datasheet; ComponentLink1URL: http://www.jst-mfg.com/product/pdf/eng/eXH.pdf
Q11 Q12 Q14 Q15 = sir158dp: N-Channel 30 V (D-S) MOSFET; ComponentLink1Description: datasheet; ComponentLink1URL: https://www.vishay.com/docs/64730/sir158dp.pdf
Q13 = ru1j002yn: N-channel 50V 200mA Small signal MOSFET; ComponentLink1Description: datasheet; ComponentLink1URL: https://www.mouser.se/datasheet/2/348/ru1j002yn-e-1018335.pdf
R39 = res_4t: Resistor; power: *; #digikey: *; #mouser: *
R40-R53 R56-R59 R61 = res: Resistor; power: *; voltage: *; #digikey: *; #mouser: *
U4 = bq2961xx: BQ296xxx Overvoltage Protection for 2-Series, 3-Series, and 4-Series Cell Li-Ion Batteries with Regulated Output Supply; ComponentLink1Description: datasheet; ComponentLink1URL: http://www.ti.com/lit/ds/symlink/bq2962.pdf
U5 = ltc4421xuhe: as U10 on sheet ext_power; ComponentLink1Description: datasheet; ComponentLink1URL: https://www.analog.com/media/en/technical-documentation/data-sheets/LTC4421.pdf

## Sheet usbpd_input.SchDoc: USB-PD
size A4; Organization: GPA Robotics; DocumentNumber: 5; Revision: REV 0; SheetNumber: 5; SheetTotal: 11
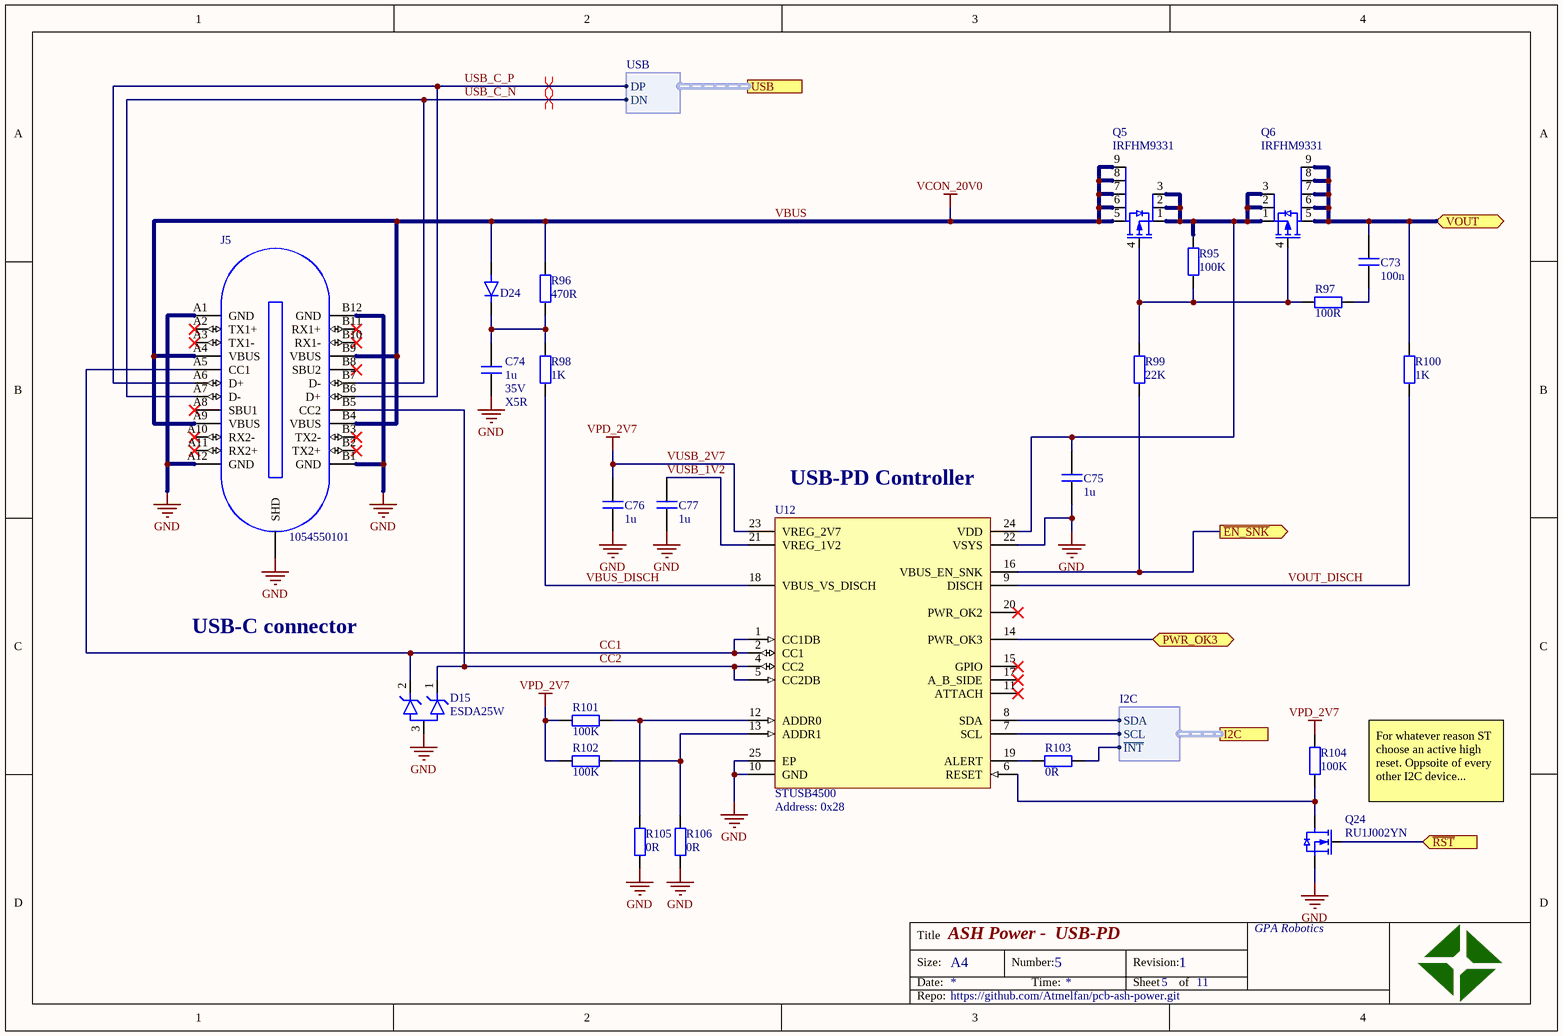
[diagram p5: usbpd_input.SchDoc]

### Parts
C73  value 100n  [CAPC1005X06N]  (hidden comment: cap)
C74  value 1u  voltage: 35V  type: X5R  [CAPC2012X11N]  (hidden comment: cap)
C75  value 1u  [CAPC2012X11N]  (hidden comment: cap)
C76  value 1u  [CAPC2012X11N]  (hidden comment: cap)
C77  value 1u  [CAPC2012X11N]  (hidden comment: cap)
D15  ESDA25W  [SOT65P210X110-3N_SOT323-3L]
D24  DFLS2100  [SODFL370X100-2N_DFLS2100]  (value not drawn)
J5  1054550101  [1054550101]
Q5  IRFHM9331  [PQFN67P300X300X100-8N]
Q6  IRFHM9331  [PQFN67P300X300X100-8N]
Q24  RU1J002YN  [SOTFL65P210X105-3N]
R95  value 100K  [RESC1005X04N]  (hidden comment: res)
R96  value 470R  [RESC2012X06N]  (hidden comment: res)
R97  value 100R  [RESC1005X04N]  (hidden comment: res)
R98  value 1K  [RESC2012X06N]  (hidden comment: res)
R99  value 22K  [RESC1005X04N]  (hidden comment: res)
R100  value 1K  [RESC1005X04N]  (hidden comment: res)
R101  value 100K  [RESC1005X04N]  (hidden comment: res)
R102  value 100K  [RESC1005X04N]  (hidden comment: res)
R103  value 0R  [RESC1005X04N]  (hidden comment: res)
R104  value 100K  [RESC1005X04N]  (hidden comment: res)
R105  value 0R  [RESC1005X04N]  (hidden comment: res)
R106  value 0R  [RESC1005X04N]  (hidden comment: res)
U12  STUSB4500  Address: 0x28  [QFN50P400X400X100_HS-25N-STUSB4500]

### Ports
I2C (harness I2C), PWR_OK3 (bidir), USB (harness USB), VOUT (bidir), ~{EN_SNK} (out), ~{RST} (in)

### Harnesses
I2C: SDA, SCL, ~{INT}
USB: DP, DN

### Nets
GND: C74.1 C75.1 C76.1 C77.1 D15.3 J5.A1(GND) J5.A12(GND) J5.B1(GND) J5.B12(GND) J5.SHD Q24.2(S) R105.1 R106.1 U12.10(GND) U12.22(VSYS) U12.25(EP)
VBUS: D24.A J5.A4(VBUS) J5.A9(VBUS) J5.B4(VBUS) J5.B9(VBUS) Q5.5(D) Q5.6(D) Q5.7(D) Q5.8(D) Q5.9(D) R96.2  [also labelled VCON_20V0]
VUSB_2V7: C76.2 R101.1 R102.1 R104.2 U12.23(VREG_2V7)  [also labelled VPD_2V7]
CC1: D15.2 J5.A5(CC1) U12.1(CC1DB) U12.2(CC1)
CC2: D15.1 J5.B5(CC2) U12.4(CC2) U12.5(CC2DB)
USB_C_N: J5.A7(D-) J5.B7(D-) ; port USB.DN
USB_C_P: J5.A6(D+) J5.B6(D+) ; port USB.DP
VBUS_DISCH: R98.1 U12.18(VBUS_VS_DISCH)
VOUT: C73.2 Q6.5(D) Q6.6(D) Q6.7(D) Q6.8(D) Q6.9(D) R100.2 ; port VOUT
VOUT_DISCH: R100.1 U12.9(DISCH)
VUSB_1V2: C77.2 U12.21(VREG_1V2)
NetC73_1: C73.1 R97.2
NetC74_2: C74.2 D24.C R96.1 R98.2
NetC75_2: C75.2 Q5.1(S) Q5.2(S) Q5.3(S) Q6.1(S) Q6.2(S) Q6.3(S) R95.2 U12.24(VDD)
NetD12_A2: U12.14(PWR_OK3) ; port PWR_OK3
NetID3_CONTROL_POW_LEG_L_LEG1_2: U12.7(SCL) ; port I2C.SCL
NetID4_CONTROL_POW_LEG_L_LEG1_2: U12.8(SDA) ; port I2C.SDA
NetQ5_4: Q5.4(G) Q6.4(G) R95.1 R97.1 R99.2
NetQ24_1: Q24.1(G) ; port ~{RST}
NetQ24_3: Q24.3(D) R104.1 U12.6(RESET)
NetR99_1: R99.1 U12.16(VBUS_EN_SNK) ; port ~{EN_SNK}
NetR101_2: R101.2 R105.2 U12.12(ADDR0)
NetR102_2: R102.2 R106.2 U12.13(ADDR1)
NetR103_1: R103.1 U12.19(ALERT)
NetR103_2: R103.2 ; port I2C.~{INT}

Not connected (* = marked no-connect by the designer): J5 A2(TX1+)* A3(TX1-)* A8(SBU1)* A10(RX2-)* A11(RX2+)* B2(TX2+)* B3(TX2-)* B8(SBU2)* B10(RX1-)* B11(RX1+)*; U12 11(ATTACH)* 15(GPIO)* 17(A_B_SIDE)* 20(PWR_OK2)*

### Layout directives
differential pair: USB_C_N, USB_C_P

### Notes on the sheet
- (near U12) USB-PD Controller
- USB-C connector
- For whatever reason ST choose an active high reset. Oppsoite of every other I2C device...
- Title
- Size:
- Date:
- A4
- Number:
- Time:
- Revision:
- Sheet
- of
- Repo:

### Library data of the parts
C73-C77 = cap: Capacitor; #digikey: *; #mouser: *
  C73 C75-C77: voltage: *; type: *
D15 = esda25w: TRANSIL array for data protection; ComponentLink1Description: datasheet; ComponentLink1URL: https://www.st.com/content/ccc/resource/technical/document/datasheet/cd/9b/8d/39/1f/d4/43/ba/CD00064033.pdf/files/CD00064033.pdf/jcr:content/translations/en.CD00064033.pdf
D24 = dfls2100: 2.0A HIGH VOLTAGE SCHOTTKY BARRIER RECTIFIER; ComponentLink1Description: datasheet; ComponentLink1URL: https://www.diodes.com/assets/Datasheets/ds31475.pdf
J5 = 1054550101: USB TYPE C REC MIDDLE MOUNT TYPE; ComponentLink1Description: drawing; ComponentLink1URL: https://www.molex.com/pdm_docs/sd/1054550101_sd.pdf
Q5 Q6 = irfhm9331: HEXFET Power MOSFET; ComponentLink1Description: datasheet; ComponentLink1URL: https://www.infineon.com/dgdl/irfhm9331pbf.pdf?fileId=5546d462533600a4015356237f7e1f59
Q24 = ru1j002yn: N-channel 50V 200mA Small signal MOSFET; ComponentLink1Description: datasheet; ComponentLink1URL: https://www.mouser.se/datasheet/2/348/ru1j002yn-e-1018335.pdf
R95-R106 = res: Resistor; power: *; voltage: *; #digikey: *; #mouser: *
U12 = stusb4500qtr: Standalone USB PD sink controller with short-to-VBUS protections; ComponentLink1Description: datasheet; ComponentLink1URL: https://www.st.com/resource/en/datasheet/stusb4500.pdf

## Sheet leg_group.SchDoc: Leg group
size A4; Organization: GPA Robotics; DocumentNumber: 8; Revision: REV 0; SheetNumber: 8; SheetTotal: 11
Used 2 times, as channels CONTROL/POW/LEG_R, CONTROL/POW/LEG_L. Parts and nets are listed once, with the designators drawn on the sheet.
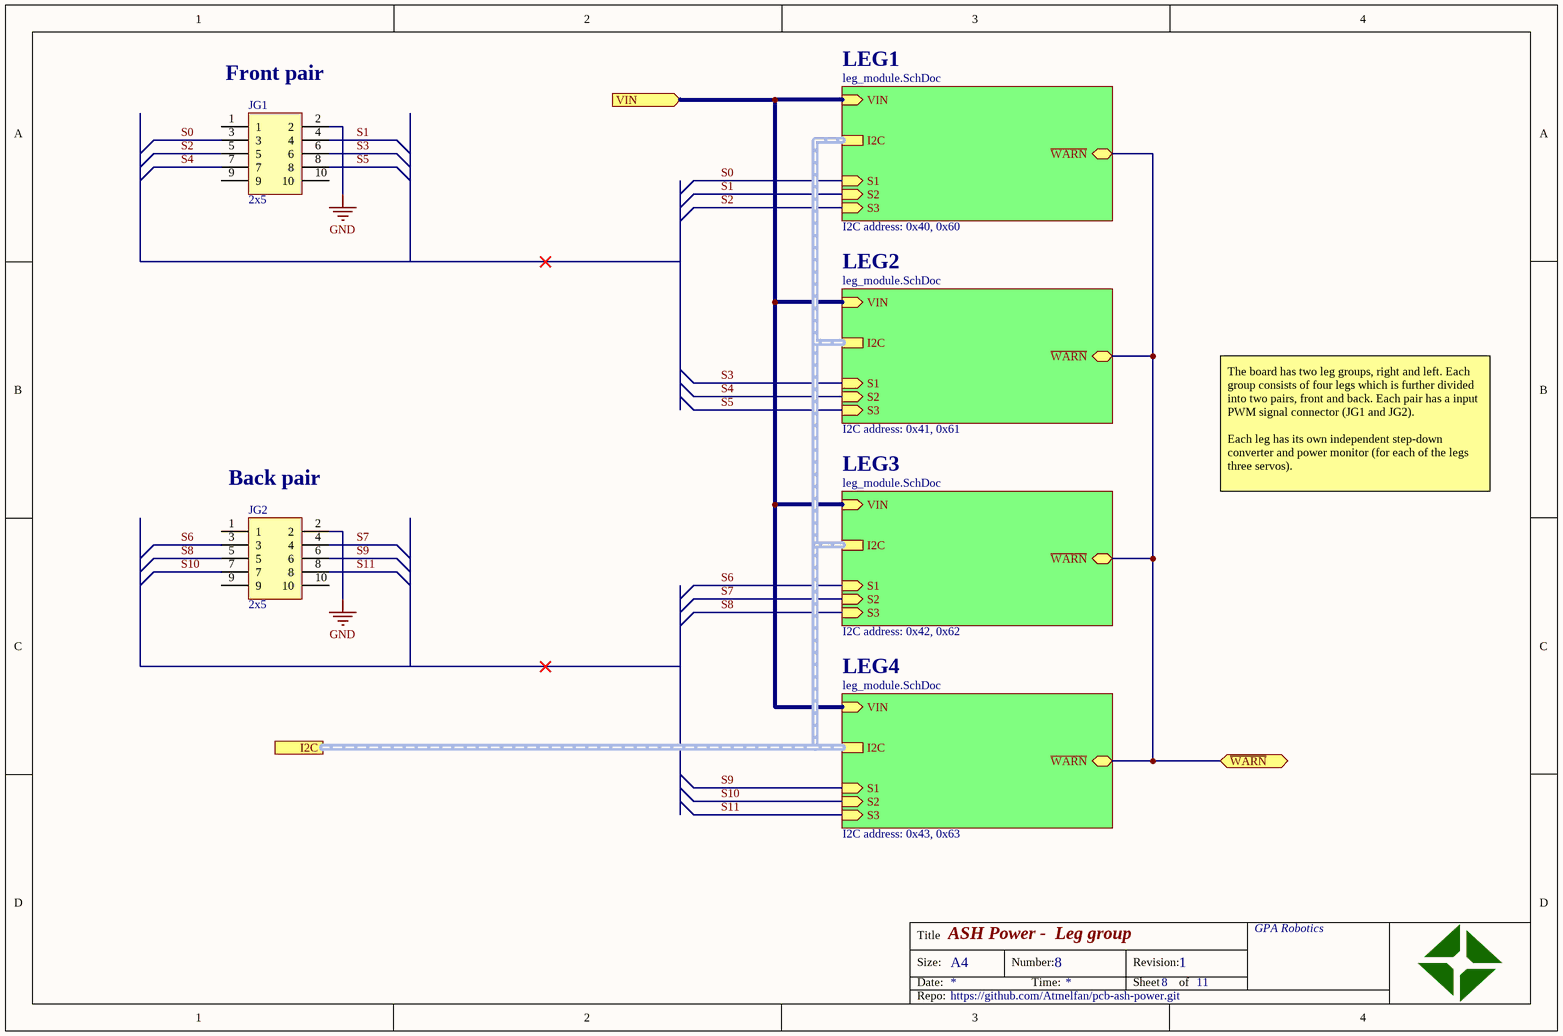
[diagram p6: leg_group.SchDoc]

### Parts
JG1  2x5  [hdr_2x5_50mil]
JG2  2x5  [hdr_2x5_50mil]

### Sub-sheets
LEG1 = leg_module.SchDoc: S1 (in), S2 (in), S3 (in), VIN (in), ~{WARN} (bidir), I2C (harness I2C)  | I2C address: 0x40, 0x60
LEG2 = leg_module.SchDoc: S1 (in), S2 (in), S3 (in), VIN (in), ~{WARN} (bidir), I2C (harness I2C)  | I2C address: 0x41, 0x61
LEG3 = leg_module.SchDoc: S1 (in), S2 (in), S3 (in), VIN (in), ~{WARN} (bidir), I2C (harness I2C)  | I2C address: 0x42, 0x62
LEG4 = leg_module.SchDoc: S1 (in), S2 (in), S3 (in), VIN (in), ~{WARN} (bidir), I2C (harness I2C)  | I2C address: 0x43, 0x63

### Ports
I2C (harness I2C), VIN (in), ~{WARN} (bidir)

### Nets
GND: JG1.2 JG2.2
~{WARN}: port ~{WARN}, sheet LEG1/~{WARN}, sheet LEG2/~{WARN}, sheet LEG3/~{WARN}, sheet LEG4/~{WARN}
S0: JG1.3 ; sheet LEG1/S1
S1: JG1.4 ; sheet LEG1/S2
S2: JG1.5 ; sheet LEG1/S3
S3: JG1.6 ; sheet LEG2/S1
S4: JG1.7 ; sheet LEG2/S2
S5: JG1.8 ; sheet LEG2/S3
S6: JG2.3 ; sheet LEG3/S1
S7: JG2.4 ; sheet LEG3/S2
S8: JG2.5 ; sheet LEG3/S3
S9: JG2.6 ; sheet LEG4/S1
S10: JG2.7 ; sheet LEG4/S2
S11: JG2.8 ; sheet LEG4/S3
VIN: port VIN, sheet LEG1/VIN, sheet LEG2/VIN, sheet LEG3/VIN, sheet LEG4/VIN

Not connected (* = marked no-connect by the designer): JG1 1 9 10; JG2 1 9 10

### Channels
CONTROL/POW/LEG_R: designators end in _LEG_R; ports VIN=NetC105_REG_L_1 ~{WARN}=NetU8_CONTROL_POW_LEG_L_LEG1_8
CONTROL/POW/LEG_L: designators end in _LEG_L; ports VIN=NetC105_REG_L_1 ~{WARN}=NetU8_CONTROL_POW_LEG_L_LEG1_8

### Buses and harness runs
harness port I2C = sheet LEG1/I2C = sheet LEG2/I2C = sheet LEG3/I2C = sheet LEG4/I2C

### Notes on the sheet
- (near JG1) Front pair
- (near JG2) Back pair
- The board has two leg groups, right and left. Each group consists of four legs which is further divided into two pairs, front and back. Each pair has a input PWM signal connector (JG1 and JG2).
  Each leg has its own independent step-down converter and power monitor (for each of the legs three servos).
- Title
- Size:
- Date:
- A4
- Number:
- Time:
- Revision:
- Sheet
- of
- Repo:

### Library data of the parts
JG1 JG2 = hdr_2x5: 2x5 Header

## Sheet leg_module.SchDoc: Leg module
size A4; Organization: GPA Robotics; DocumentNumber: 9; Revision: REV 0; SheetNumber: 9; SheetTotal: 11
Used 8 times, as channels CONTROL/POW/LEG_R/LEG1, CONTROL/POW/LEG_R/LEG2, CONTROL/POW/LEG_R/LEG3, CONTROL/POW/LEG_R/LEG4, CONTROL/POW/LEG_L/LEG1, CONTROL/POW/LEG_L/LEG2, CONTROL/POW/LEG_L/LEG3, CONTROL/POW/LEG_L/LEG4. Parts and nets are listed once, with the designators drawn on the sheet.
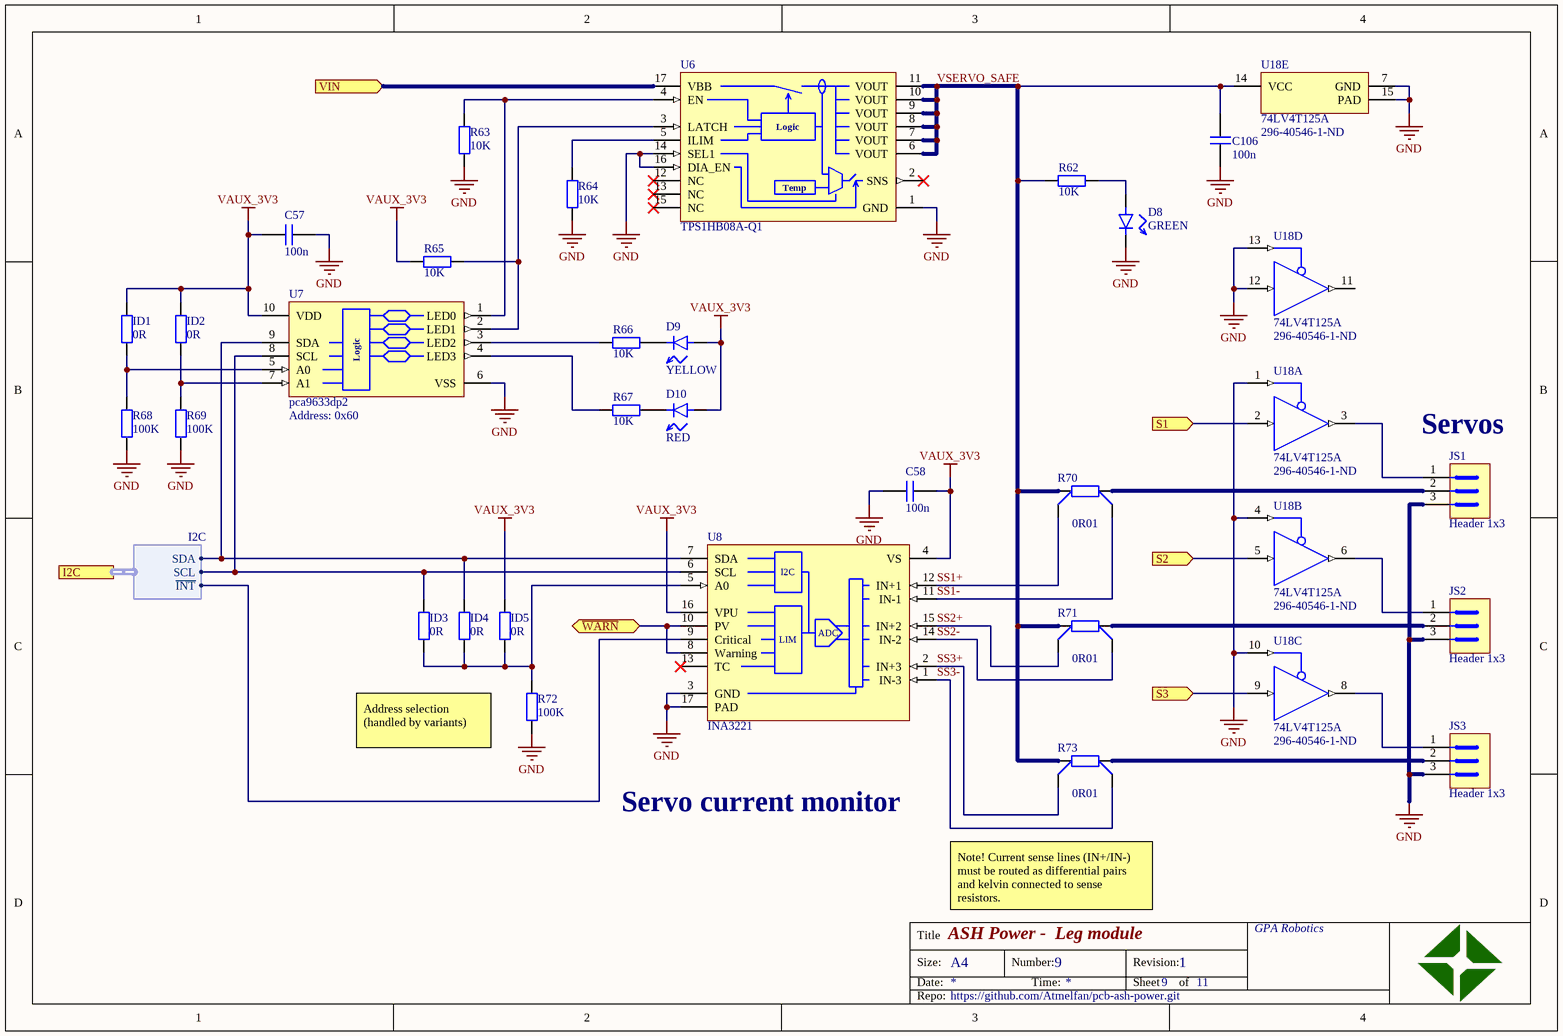
[diagram p7: leg_module.SchDoc]

### Parts
C57  value 100n  [CAPC1005X06N]  (hidden comment: cap)
C58  value 100n  [CAPC1005X06N]  (hidden comment: cap)
C106  value 100n  [CAPC1005X06N]  (hidden comment: cap)
D8  value GREEN  [CAPCP1005X06N]  (hidden comment: led)
D9  value YELLOW  [CAPCP1005X06N]  (hidden comment: led)
D10  value RED  [CAPCP1005X06N]  (hidden comment: led)
ID1  value 0R  [RESC1005X04N]  (hidden comment: res)
ID2  value 0R  [RESC1005X04N]  (hidden comment: res)
ID3  value 0R  [RESC1005X04N]  (hidden comment: res)
ID4  value 0R  [RESC1005X04N]  (hidden comment: res)
ID5  value 0R  [RESC1005X04N]  (hidden comment: res)
JS1  Header 1x3  [HEADER_1x3_100MIL]
JS2  Header 1x3  [HEADER_1x3_100MIL]
JS3  Header 1x3  [HEADER_1x3_100MIL]
R62  value 10K  [RESC1005X04N]  (hidden comment: res)
R63  value 10K  [RESC1005X04N]  (hidden comment: res)
R64  value 10K  [RESC1005X04N]  (hidden comment: res)
R65  value 10K  [RESC1005X04N]  (hidden comment: res)
R66  value 10K  [RESC1005X04N]  (hidden comment: res)
R67  value 10K  [RESC1005X04N]  (hidden comment: res)
R68  value 100K  [RESC1005X04N]  (hidden comment: res)
R69  value 100K  [RESC1005X04N]  (hidden comment: res)
R70  value 0R01  [4T_RESC1632X05N]  (hidden comment: res_4t)
R71  value 0R01  [4T_RESC1632X05N]  (hidden comment: res_4t)
R72  value 100K  [RESC1005X04N]  (hidden comment: res)
R73  value 0R01  [4T_RESC1632X05N]  (hidden comment: res_4t)
U6  TPS1HB08A-Q1  [TSOP65P640X120_HS-17N_TPS1HB08]
U7  pca9633dp2  Address: 0x60  [TSSOP50P490X110-10N_PCA9633DP2]
U8  INA3221  [QFN65P400X400X100_HS-17N_INA3221]
U18  74LV4T125A  Supplier Part Number 1: 296-40546-1-ND  [QFN50P350X350X100_HS-15N]  (parts A,B,C,D,E of 5)

### Ports
I2C (harness I2C), S1 (in), S2 (in), S3 (in), VIN (in), ~{WARN} (bidir)

### Harnesses
I2C: SDA, SCL, ~{INT}

### Nets
GND: C57.1 C58.1 C106.1 D8.C JS1.3 JS2.3 JS3.3 R63.1 R64.1 R68.1 R69.1 R72.1 U6.1(GND) U6.14(SEL1) U6.16(DIA_EN) U7.6(VSS) U8.3(GND) U8.17(PAD) U18.1(1OE) U18.4(2OE) U18.7(GND) U18.10(3OE) U18.12(4A) U18.13(4OE) U18.15(PAD)
VAUX_3V3: C57.2 C58.2 D9.A D10.A ID1.2 ID2.2 ID5.2 R65.1 U7.10(VDD) U8.4(VS) U8.16(VPU)
~{WARN}: U8.8(Warning) U8.10(PV) ; port ~{WARN}
S1: U18.2(1A) ; port S1
S2: U18.5(2A) ; port S2
S3: U18.9(3A) ; port S3
SS1+: R70.3 U8.12(IN+1)
SS1-: R70.4 U8.11(IN-1)
SS2+: R71.3 U8.15(IN+2)
SS2-: R71.4 U8.14(IN-2)
SS3+: R73.3 U8.2(IN+3)
SS3-: R73.4 U8.1(IN-3)
VIN: U6.17(VBB) ; port VIN
VSERVO_SAFE: C106.2 R62.1 R70.1 R71.1 R73.1 U6.6(VOUT) U6.7(VOUT) U6.8(VOUT) U6.9(VOUT) U6.10(VOUT) U6.11(VOUT) U18.14(VCC)
NetD8_A: D8.A R62.2
NetD9_C: D9.C R66.1
NetD10_C: D10.C R67.1
NetID1_1: ID1.1 R68.2 U7.5(A0)
NetID2_1: ID2.1 R69.2 U7.7(A1)
NetID3_1: ID3.1 ID4.1 ID5.1 R72.2 U8.5(A0)
NetID3_2: ID3.2 U7.8(SCL) U8.6(SCL) ; port I2C.SCL
NetID4_2: ID4.2 U7.9(SDA) U8.7(SDA) ; port I2C.SDA
NetJS1_1: JS1.1 U18.3(1Y)
NetJS1_2: JS1.2 R70.2
NetJS2_1: JS2.1 U18.6(2Y)
NetJS2_2: JS2.2 R71.2
NetJS3_1: JS3.1 U18.8(3Y)
NetJS3_2: JS3.2 R73.2
NetR63_2: R63.2 U6.4(EN) U7.1(LED0)
NetR64_2: R64.2 U6.5(ILIM)
NetR65_2: R65.2 U6.3(LATCH) U7.2(LED1)
NetR66_2: R66.2 U7.3(LED2)
NetR67_2: R67.2 U7.4(LED3)
NetU8_9: U8.9(Critical) ; port I2C.~{INT}

Not connected (* = marked no-connect by the designer): U6 2(SNS)* 12(NC)* 13(NC)* 15(NC)*; U8 13(TC)*; U18 11(4Y)

### Channels
CONTROL/POW/LEG_R/LEG1: designators end in _CONTROL_POW_LEG_R_LEG1; ports S1=NetU18_CONTROL_POW_LEG_L_LEG1_2 S2=NetU18_CONTROL_POW_LEG_L_LEG1_5 S3=NetU18_CONTROL_POW_LEG_L_LEG1_9 VIN=NetC105_REG_L_1 ~{WARN}=NetU8_CONTROL_POW_LEG_L_LEG1_8
CONTROL/POW/LEG_R/LEG2: designators end in _CONTROL_POW_LEG_R_LEG2; ports S1=NetU18_CONTROL_POW_LEG_L_LEG1_2 S2=NetU18_CONTROL_POW_LEG_L_LEG1_5 S3=NetU18_CONTROL_POW_LEG_L_LEG1_9 VIN=NetC105_REG_L_1 ~{WARN}=NetU8_CONTROL_POW_LEG_L_LEG1_8
CONTROL/POW/LEG_R/LEG3: designators end in _CONTROL_POW_LEG_R_LEG3; ports S1=NetU18_CONTROL_POW_LEG_L_LEG1_2 S2=NetU18_CONTROL_POW_LEG_L_LEG1_5 S3=NetU18_CONTROL_POW_LEG_L_LEG1_9 VIN=NetC105_REG_L_1 ~{WARN}=NetU8_CONTROL_POW_LEG_L_LEG1_8
CONTROL/POW/LEG_R/LEG4: designators end in _CONTROL_POW_LEG_R_LEG4; ports S1=NetU18_CONTROL_POW_LEG_L_LEG1_2 S2=NetU18_CONTROL_POW_LEG_L_LEG1_5 S3=NetU18_CONTROL_POW_LEG_L_LEG1_9 VIN=NetC105_REG_L_1 ~{WARN}=NetU8_CONTROL_POW_LEG_L_LEG1_8
CONTROL/POW/LEG_L/LEG1: designators end in _CONTROL_POW_LEG_L_LEG1; ports S1=NetU18_CONTROL_POW_LEG_L_LEG1_2 S2=NetU18_CONTROL_POW_LEG_L_LEG1_5 S3=NetU18_CONTROL_POW_LEG_L_LEG1_9 VIN=NetC105_REG_L_1 ~{WARN}=NetU8_CONTROL_POW_LEG_L_LEG1_8
CONTROL/POW/LEG_L/LEG2: designators end in _CONTROL_POW_LEG_L_LEG2; ports S1=NetU18_CONTROL_POW_LEG_L_LEG1_2 S2=NetU18_CONTROL_POW_LEG_L_LEG1_5 S3=NetU18_CONTROL_POW_LEG_L_LEG1_9 VIN=NetC105_REG_L_1 ~{WARN}=NetU8_CONTROL_POW_LEG_L_LEG1_8
CONTROL/POW/LEG_L/LEG3: designators end in _CONTROL_POW_LEG_L_LEG3; ports S1=NetU18_CONTROL_POW_LEG_L_LEG1_2 S2=NetU18_CONTROL_POW_LEG_L_LEG1_5 S3=NetU18_CONTROL_POW_LEG_L_LEG1_9 VIN=NetC105_REG_L_1 ~{WARN}=NetU8_CONTROL_POW_LEG_L_LEG1_8
CONTROL/POW/LEG_L/LEG4: designators end in _CONTROL_POW_LEG_L_LEG4; ports S1=NetU18_CONTROL_POW_LEG_L_LEG1_2 S2=NetU18_CONTROL_POW_LEG_L_LEG1_5 S3=NetU18_CONTROL_POW_LEG_L_LEG1_9 VIN=NetC105_REG_L_1 ~{WARN}=NetU8_CONTROL_POW_LEG_L_LEG1_8

### Notes on the sheet
- (near JS1) Servos
- Address selection
  (handled by variants)
- Servo current monitor
- Note! Current sense lines (IN+/IN-) must be routed as differential pairs and kelvin connected to sense resistors.
- Title
- Size:
- Date:
- A4
- Number:
- Time:
- Revision:
- Sheet
- of
- Repo:
- (in symbol ina3221) I2C; ADC; LIM
- (in symbol pca9633dp2) Logic
- (in symbol tps1hb08a) Logic; Temp

### Library data of the parts
C57 C58 C106 = cap: Capacitor; voltage: *; type: *; #digikey: *; #mouser: *
D8-D10 = led: pin to pad: A>1 C>2
ID1-ID5 R62-R69 R72 = res: Resistor; power: *; voltage: *; #digikey: *; #mouser: *
JS1-JS3 = header_1x3_100mil: 2.54mm pitch single row header
R70 R71 R73 = res_4t: Resistor; power: *; #digikey: *; #mouser: *
U6 = tps1hb08a: 40-V, 8-mΩ Single-Channel Smart High-Side Switch; ComponentLink1Description: datasheet; ComponentLink1URL: http://www.ti.com/lit/ds/symlink/tps1hb08-q1.pdf
U7 = pca9633dp2: 4-bit Fm+ I2C-bus LED driver; ComponentLink1Description: datasheet; ComponentLink1URL: https://www.nxp.com/docs/en/data-sheet/PCA9633.pdf?
U8 = ina3221: Triple-Channel, High-Side Measurement. Shunt and Bus Voltage Monitor with I 2 C- and SMBUS-Compatible Interface; ComponentLink1Description: datasheet; ComponentLink1URL: http://www.ti.com/lit/ds/sbos576b/sbos576b.pdf
U18 = sn74lv4t125a: Quadruple Bus Buffer Gates With 3-State Outputs; #digikey: *; #mouser: *; ComponentLink1Description: Datasheet; ComponentLink1URL: http://www.ti.com/lit/ds/symlink/sn74lv125a.pdf; Supplier 1: Digi-Key

## Sheet gan_buck.SchDoc: GaN Step-down
size A4; Organization: GPA Robotics; DocumentNumber: 7; Revision: REV 0; SheetNumber: 7; SheetTotal: 11
Used 2 times, as channels CONTROL/POW/REG_R, CONTROL/POW/REG_L. Parts and nets are listed once, with the designators drawn on the sheet.
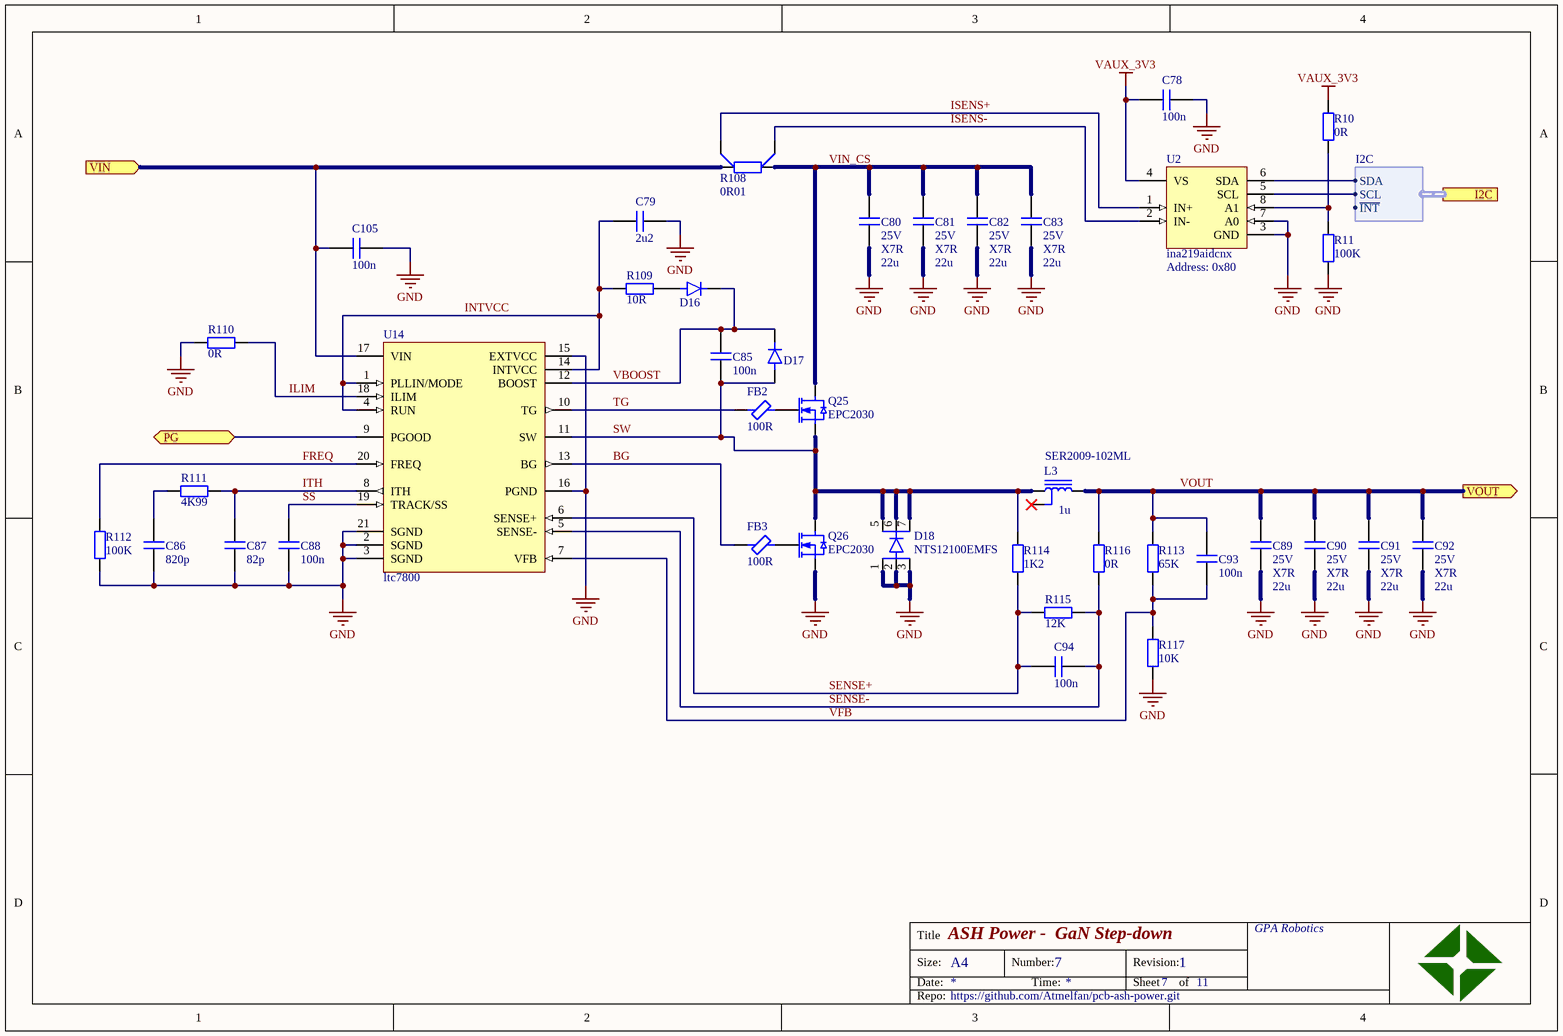
[diagram p8: gan_buck.SchDoc]

### Parts
C78  value 100n  [CAPC1005X06N]  (hidden comment: cap)
C79  value 2u2  [CAPC2012X11N]  (hidden comment: cap)
C80  value 22u  voltage: 25V  type: X7R  [CAPC3225X14N]  (hidden comment: cap)
C81  value 22u  voltage: 25V  type: X7R  [CAPC3225X14N]  (hidden comment: cap)
C82  value 22u  voltage: 25V  type: X7R  [CAPC3225X14N]  (hidden comment: cap)
C83  value 22u  voltage: 25V  type: X7R  [CAPC3225X14N]  (hidden comment: cap)
C85  value 100n  [CAPC1608X08N]  (hidden comment: cap)
C86  value 820p  [CAPC1005X06N]  (hidden comment: cap)
C87  value 82p  [CAPC1005X06N]  (hidden comment: cap)
C88  value 100n  [CAPC1005X06N]  (hidden comment: cap)
C89  value 22u  voltage: 25V  type: X7R  [CAPC3225X14N]  (hidden comment: cap)
C90  value 22u  voltage: 25V  type: X7R  [CAPC3225X14N]  (hidden comment: cap)
C91  value 22u  voltage: 25V  type: X7R  [CAPC3225X14N]  (hidden comment: cap)
C92  value 22u  voltage: 25V  type: X7R  [CAPC3225X14N]  (hidden comment: cap)
C93  value 100n  [CAPC1005X06N]  (hidden comment: cap)
C94  value 100n  [CAPC1005X06N]  (hidden comment: cap)
C105  value 100n  [CAPC1005X06N]  (hidden comment: cap)
D16  DFLS2100  [SODFL370X100-2N_DFLS2100]  (value not drawn)
D17  diode  [CAPCP1005X06N]  (value not drawn)
D18  NTS12100EMFS  [SON127P620X110_HS-9N_NTS12100]
FB2  value 100R  [INDC1005X06N]  (hidden comment: ferrite)
FB3  value 100R  [INDC1005X06N]  (hidden comment: ferrite)
L3  SER2009-102ML  value 1u  [SER20xx]
Q25  EPC2030  [epc2030_die]
Q26  EPC2030  [epc2030_die]
R10  value 0R  [RESC1005X04N]  (hidden comment: res)
R11  value 100K  [RESC1005X04N]  (hidden comment: res)
R108  value 0R01  [4T_RESC1632X05N]  (hidden comment: res_4t)
R109  value 10R  [RESC2012X06N]  (hidden comment: res)
R110  value 0R  [RESC1005X04N]  (hidden comment: res)
R111  value 4K99  [RESC1005X04N]  (hidden comment: res)
R112  value 100K  [RESC1005X04N]  (hidden comment: res)
R113  value 65K  [RESC1005X04N]  (hidden comment: res)
R114  value 1K2  [RESC1005X04N]  (hidden comment: res)
R115  value 12K  [RESC1005X04N]  (hidden comment: res)
R116  value 0R  [RESC1005X04N]  (hidden comment: res)
R117  value 10K  [RESC1005X04N]  (hidden comment: res)
U2  ina219aidcnx  Address: 0x80  [TSOP65P280X145-8N]
U14  ltc7800  [QFN50P300X400X80_HS-21N_LTC7800]

### Ports
I2C (harness I2C), PG (bidir), VIN (in), VOUT (out)

### Harnesses
I2C: SDA, SCL, ~{INT}

### Nets
GND: C78.1 C79.2 C80.2 C81.2 C82.2 C83.2 C86.1 C87.1 C88.1 C89.2 C90.2 C91.2 C92.2 C105.2 D18.1 D18.2 D18.3 Q26.S R11.1 R110.2 R112.1 R117.1 U2.3(GND) U2.7(A0) U14.2(SGND) U14.3(SGND) U14.15(EXTVCC) U14.16(PGND) U14.21(SGND)
VAUX_3V3: C78.2 R10.2 U2.4(VS)
BG: FB3.1 U14.13(BG)
FREQ: R112.2 U14.20(FREQ)
ILIM: R110.1 U14.18(ILIM)
INTVCC: C79.1 R109.1 U14.1(PLLIN/MODE) U14.4(RUN) U14.14(INTVCC)
ISENS+: R108.4 U2.1(IN+)
ISENS-: R108.3 U2.2(IN-)
ITH: C87.2 R111.2 U14.8(ITH)
PG: U14.9(PGOOD) ; port PG
SENSE+: C94.1 R114.1 R115.2 U14.6(SENSE+)
SENSE-: C94.2 R115.1 R116.1 U14.5(SENSE-)
SS: C88.2 U14.19(TRACK/SS)
SW: C85.1 D17.A D18.5 D18.6 D18.7 L3.2 Q25.S Q26.D R114.2 U14.11(SW)
TG: FB2.1 U14.10(TG)
VBOOST: C85.2 D16.C D17.C U14.12(BOOST)
VFB: C93.1 R113.1 R117.2 U14.7(VFB)
VIN: C105.1 R108.2 U14.17(VIN) ; port VIN
VIN_CS: C80.1 C81.1 C82.1 C83.1 Q25.D R108.1
VOUT: C89.1 C90.1 C91.1 C92.1 C93.2 L3.1 R113.2 R116.2 ; port VOUT
NetC86_2: C86.2 R111.1
NetD16_A: D16.A R109.2
NetFB2_2: FB2.2 Q25.G
NetFB3_2: FB3.2 Q26.G
NetR10_1: R10.1 R11.2 U2.8(A1)
NetU2_5: U2.5(SCL) ; port I2C.SCL
NetU2_6: U2.6(SDA) ; port I2C.SDA

Not connected (* = marked no-connect by the designer): L3 3*

### Channels
CONTROL/POW/REG_R: designators end in _REG_R; ports PG=NetU14_REG_L_9 VIN=NetC105_REG_L_1 VOUT=VOUT
CONTROL/POW/REG_L: designators end in _REG_L; ports PG=NetU14_REG_L_9 VIN=NetC105_REG_L_1 VOUT=VOUT

### Notes on the sheet
- Title
- Size:
- Date:
- A4
- Number:
- Time:
- Revision:
- Sheet
- of
- Repo:

### Library data of the parts
C78-C83 C85-C94 C105 = cap: Capacitor; #digikey: *; #mouser: *
  C78 C79 C85-C88 C93 C94 C105: voltage: *; type: *
D16 = dfls2100: as D24 on sheet usbpd_input; ComponentLink1Description: datasheet; ComponentLink1URL: https://www.diodes.com/assets/Datasheets/ds31475.pdf
D17 = diode: pin to pad: A>1 C>2
D18 = nts12100emfs: Very Low LeakageTrench-based SchottkyRectifier; ComponentLink1Description: datasheet; ComponentLink1URL: https://www.onsemi.com/pub/Collateral/NTS12100EMFS-D.PDF
FB2 FB3 = ferrite: Inductor; #digikey: *; #mouser: *
L3 = ser20xx: Shielded Power Inductor; ComponentLink1Description: specs; ComponentLink1URL: https://www.coilcraft.com/pdfs/ser2000.pdf
Q25 Q26 = epc2030: GaN Enhancement Mode Power Transistor; ComponentLink1Description: datasheet; ComponentLink1URL: https://epc-co.com/epc/Portals/0/epc/documents/datasheets/EPC2030_datasheet.pdf
R10 R11 R109-R117 = res: Resistor; power: *; voltage: *; #digikey: *; #mouser: *
R108 = res_4t: Resistor; power: *; #digikey: *; #mouser: *
U2 = ina219aidcnx: INA219 Zero-Drift, Bidirectional Current/Power Monitor With I2C Interface; ComponentLink1Description: Datasheet; ComponentLink1URL: https://www.ti.com/lit/ds/symlink/ina219.pdf?&ts=1589650364826; Supplier 1: Digi-Key; Supplier Part Number 1: 296-23770-1-ND
U14 = ltc7800: Low IQ, 60V, High Frequency Synchronous Step-Down Controller; ComponentLink1Description: datasheet; ComponentLink1URL: https://www.analog.com/media/en/technical-documentation/data-sheets/7800f.pdf